# EasyEDA schematic SCH_Scope 1014D_2022-05-10.json

## Sheets
1 Scope_1014D_Processor: TITLE: Processor; REV: 1.0; Date: 2022-05-08; Sheet: 1/6
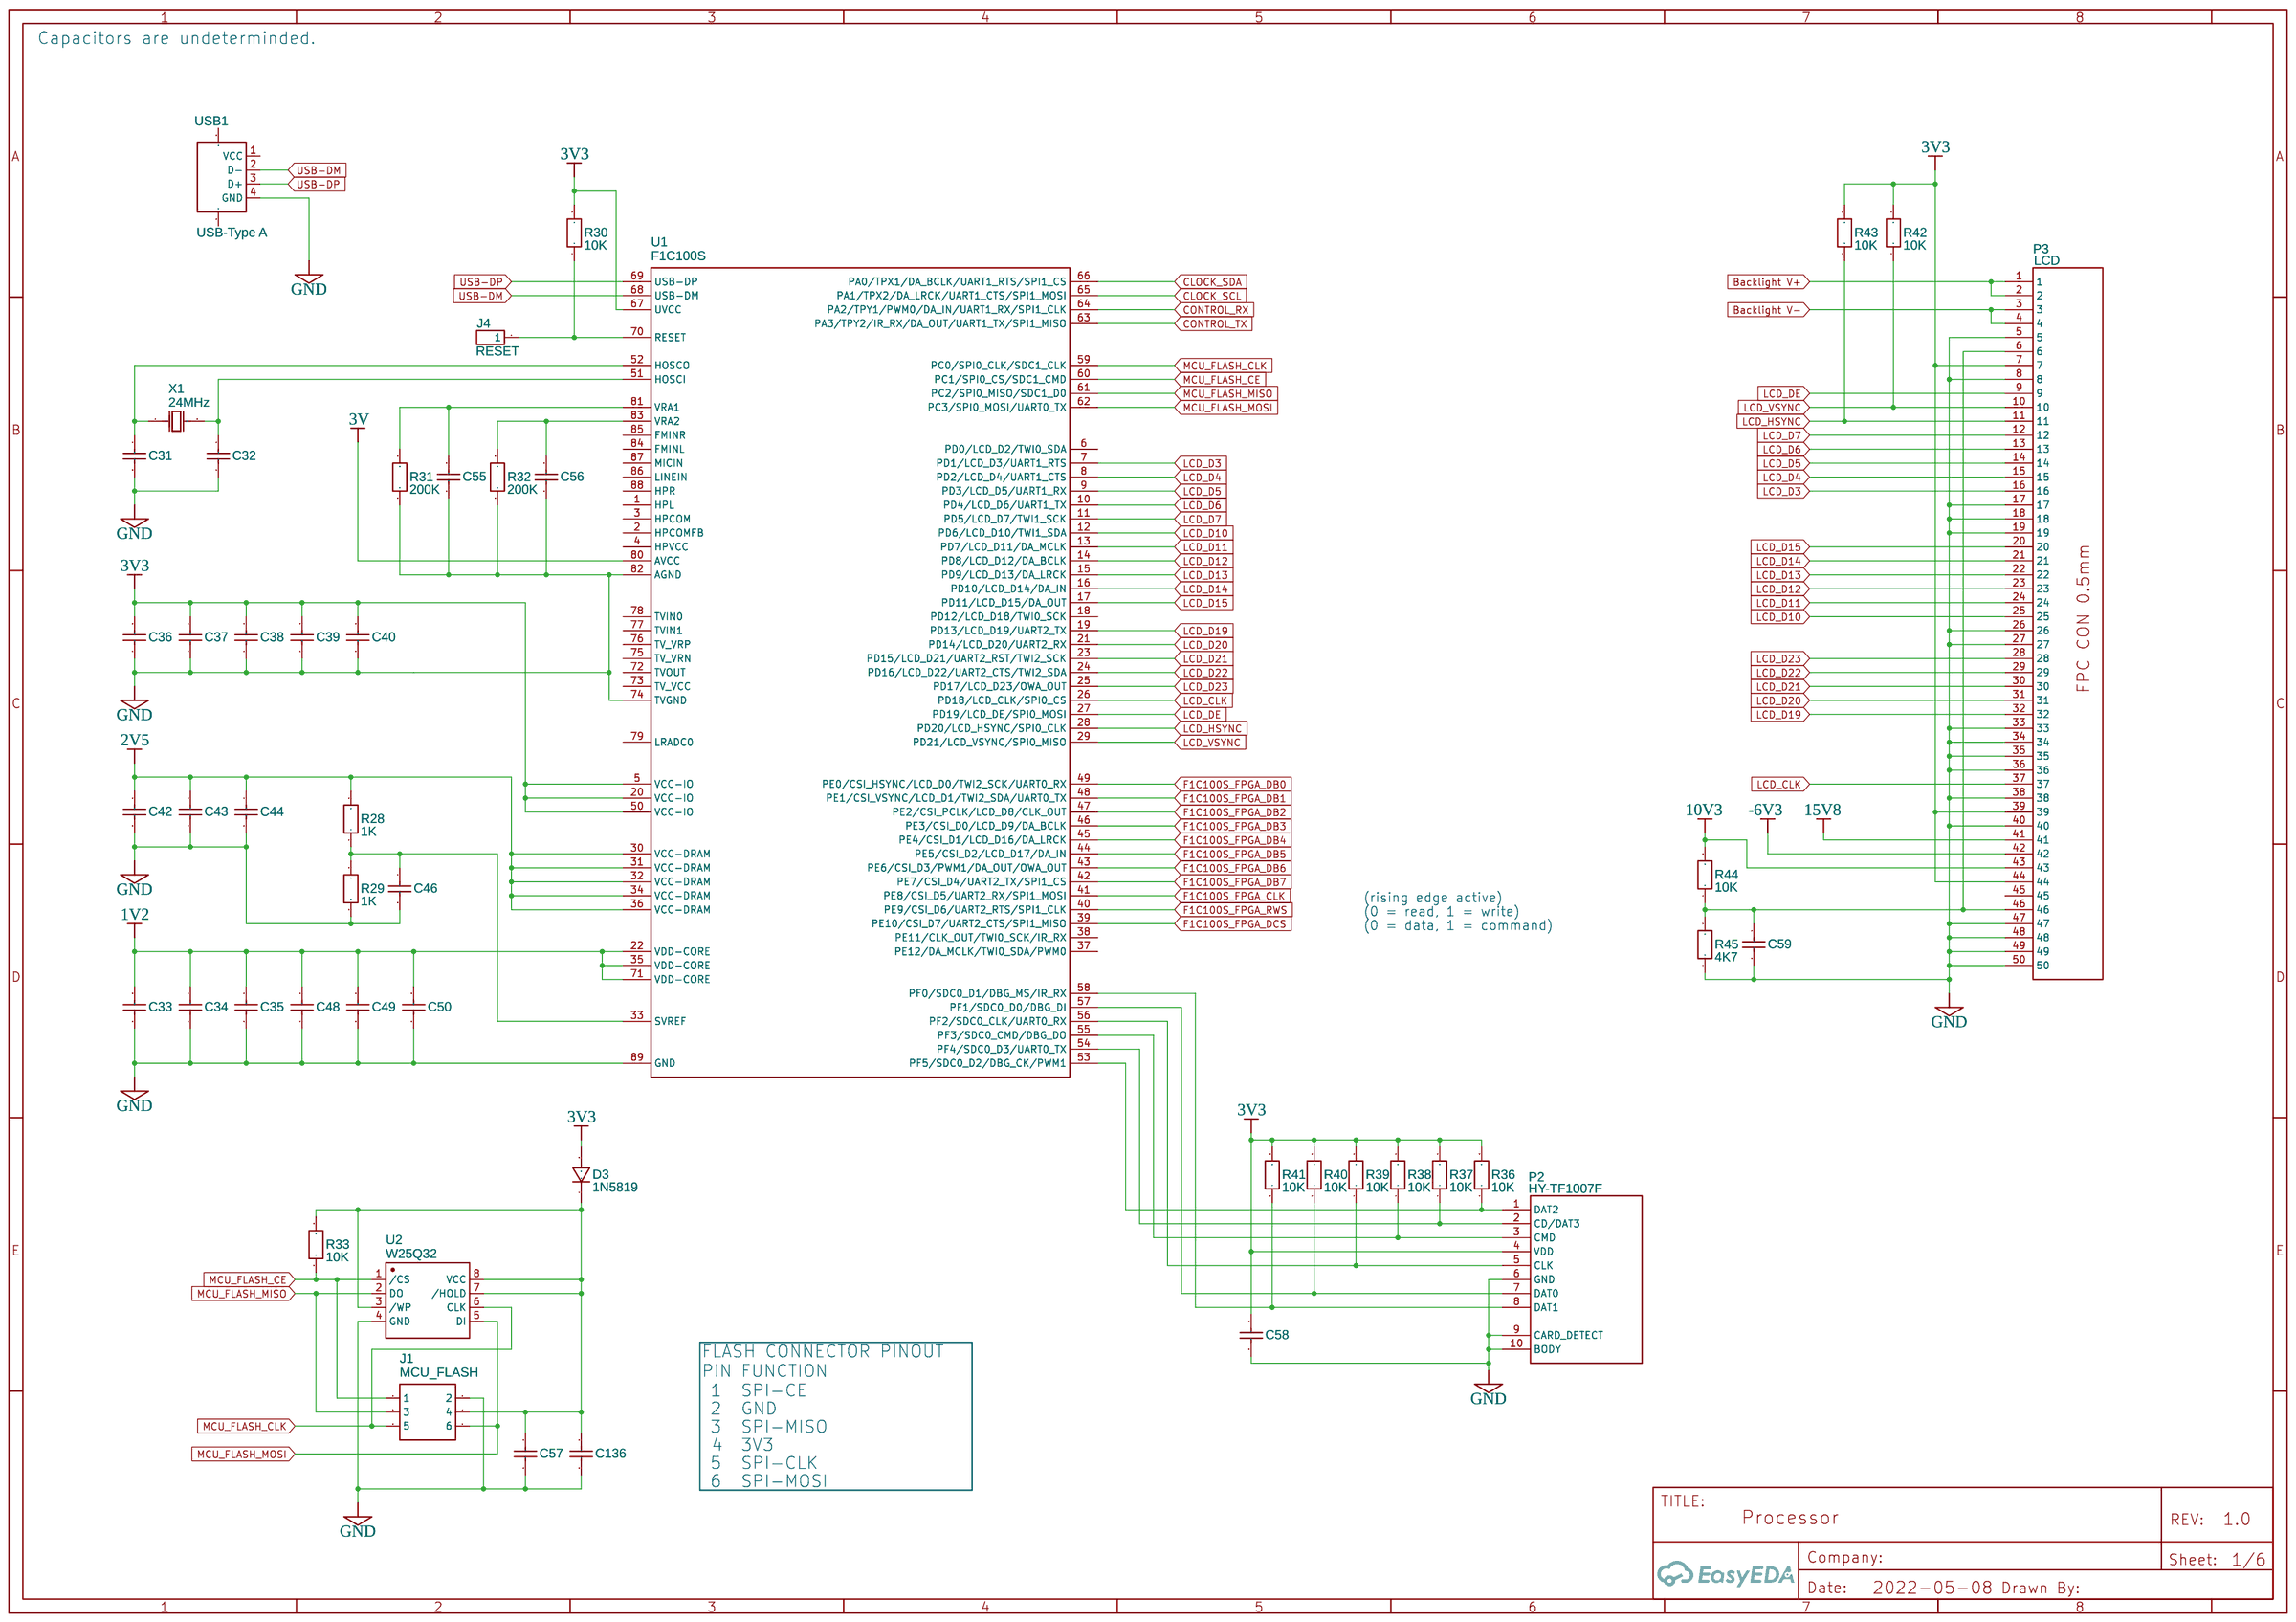
[diagram p0: Scope_1014D_Processor]
2 Scope_1014D_Data_Acquisition: TITLE: FPGA; Sheet: 2/6
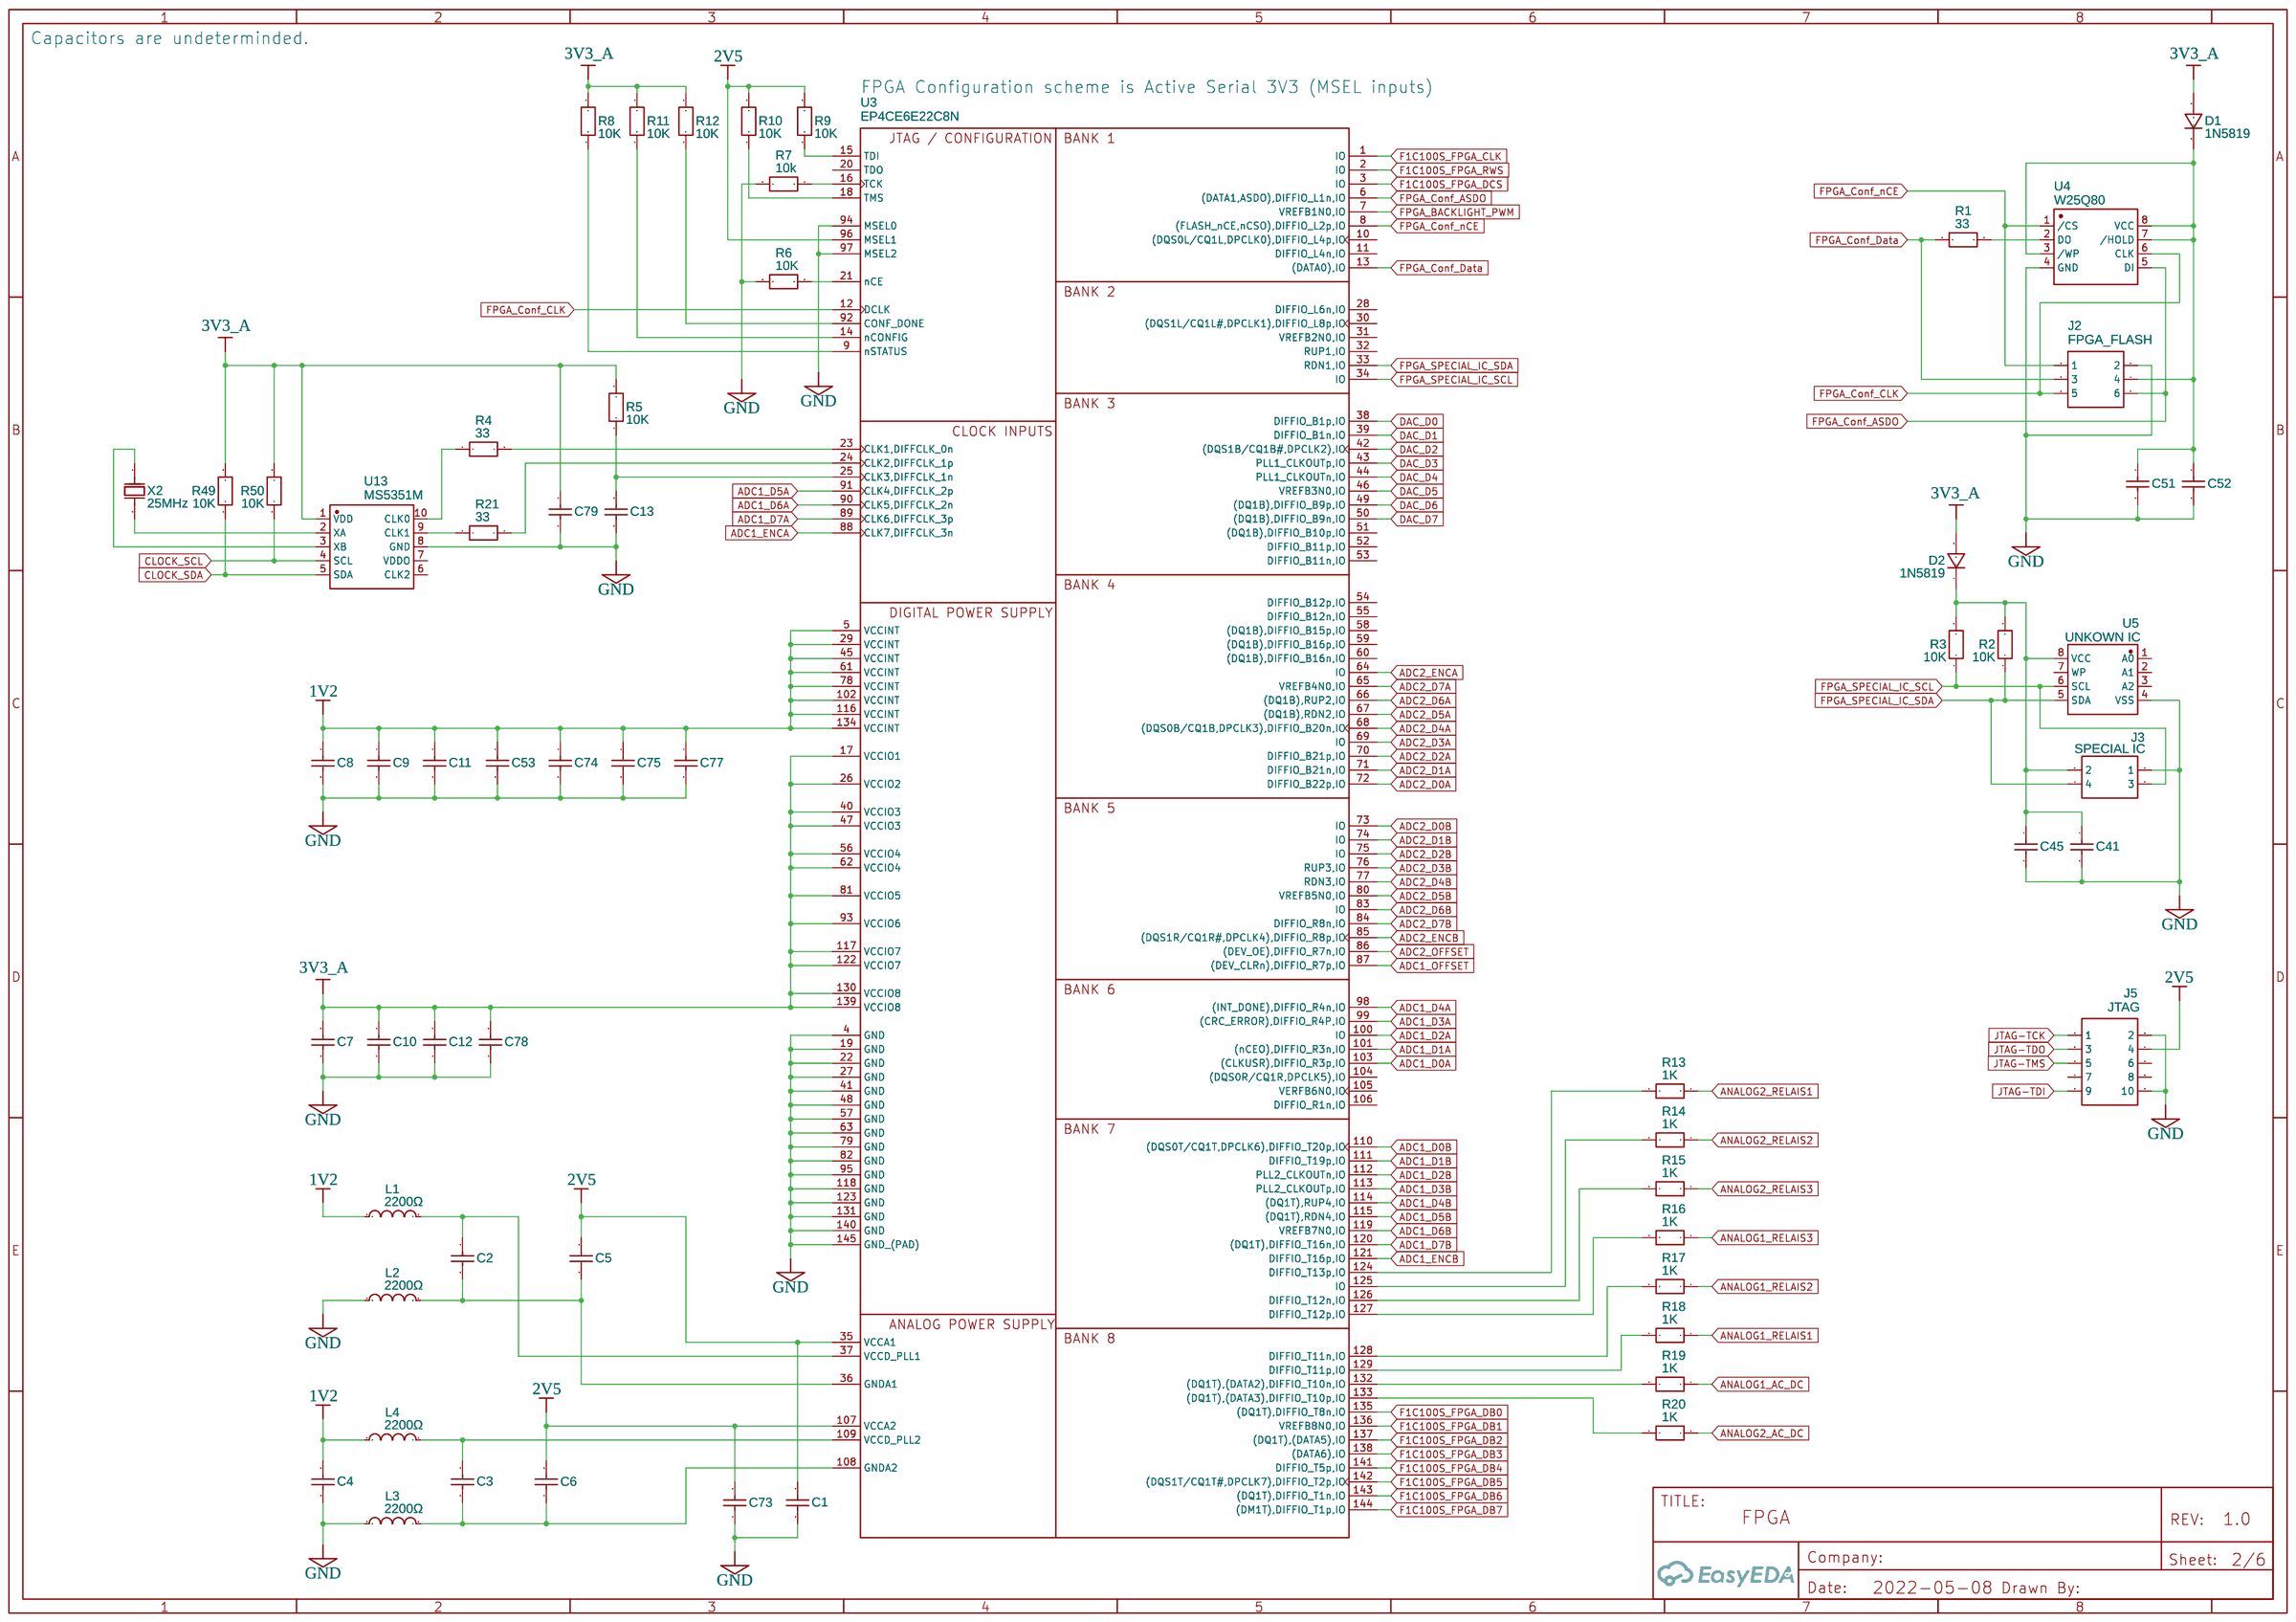
[diagram p1: Scope_1014D_Data_Acquisition]
3 Scope_1014D_Analog_Input: TITLE: Analog Input; Sheet: 4/6
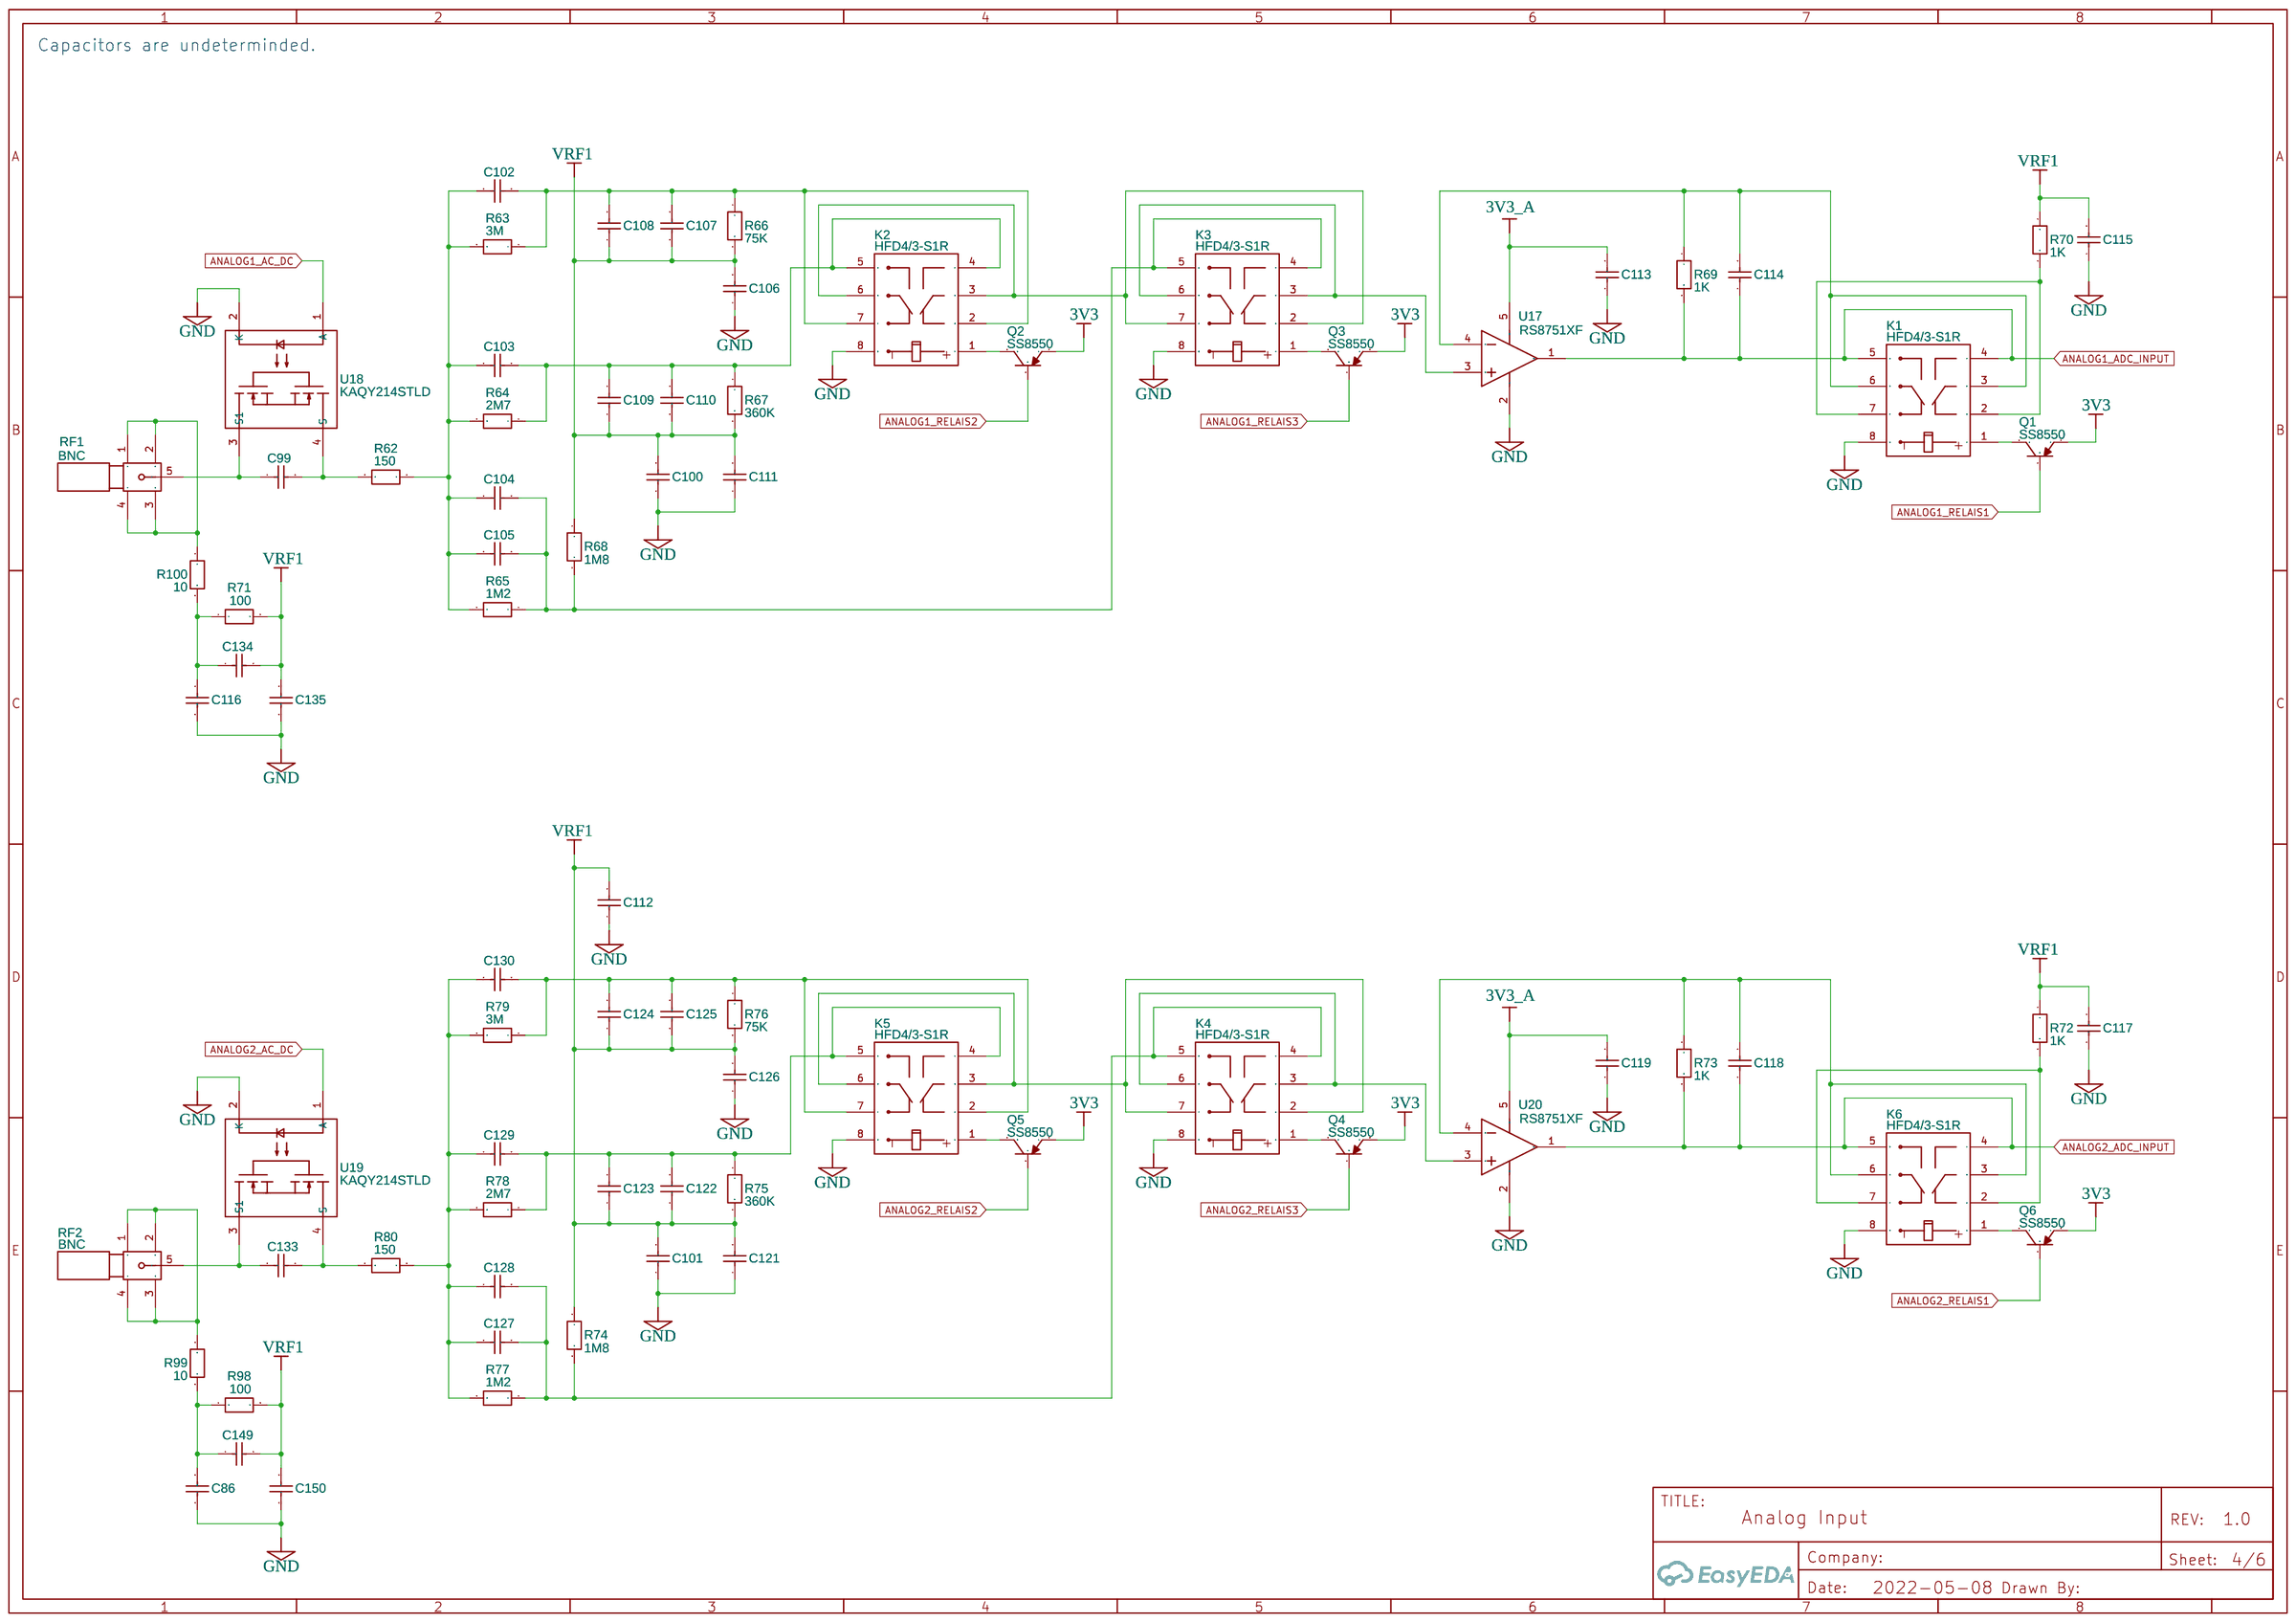
[diagram p2: Scope_1014D_Analog_Input]
4 Scope_1014D_Power_Supply: TITLE: Power Supply; Sheet: 6/6
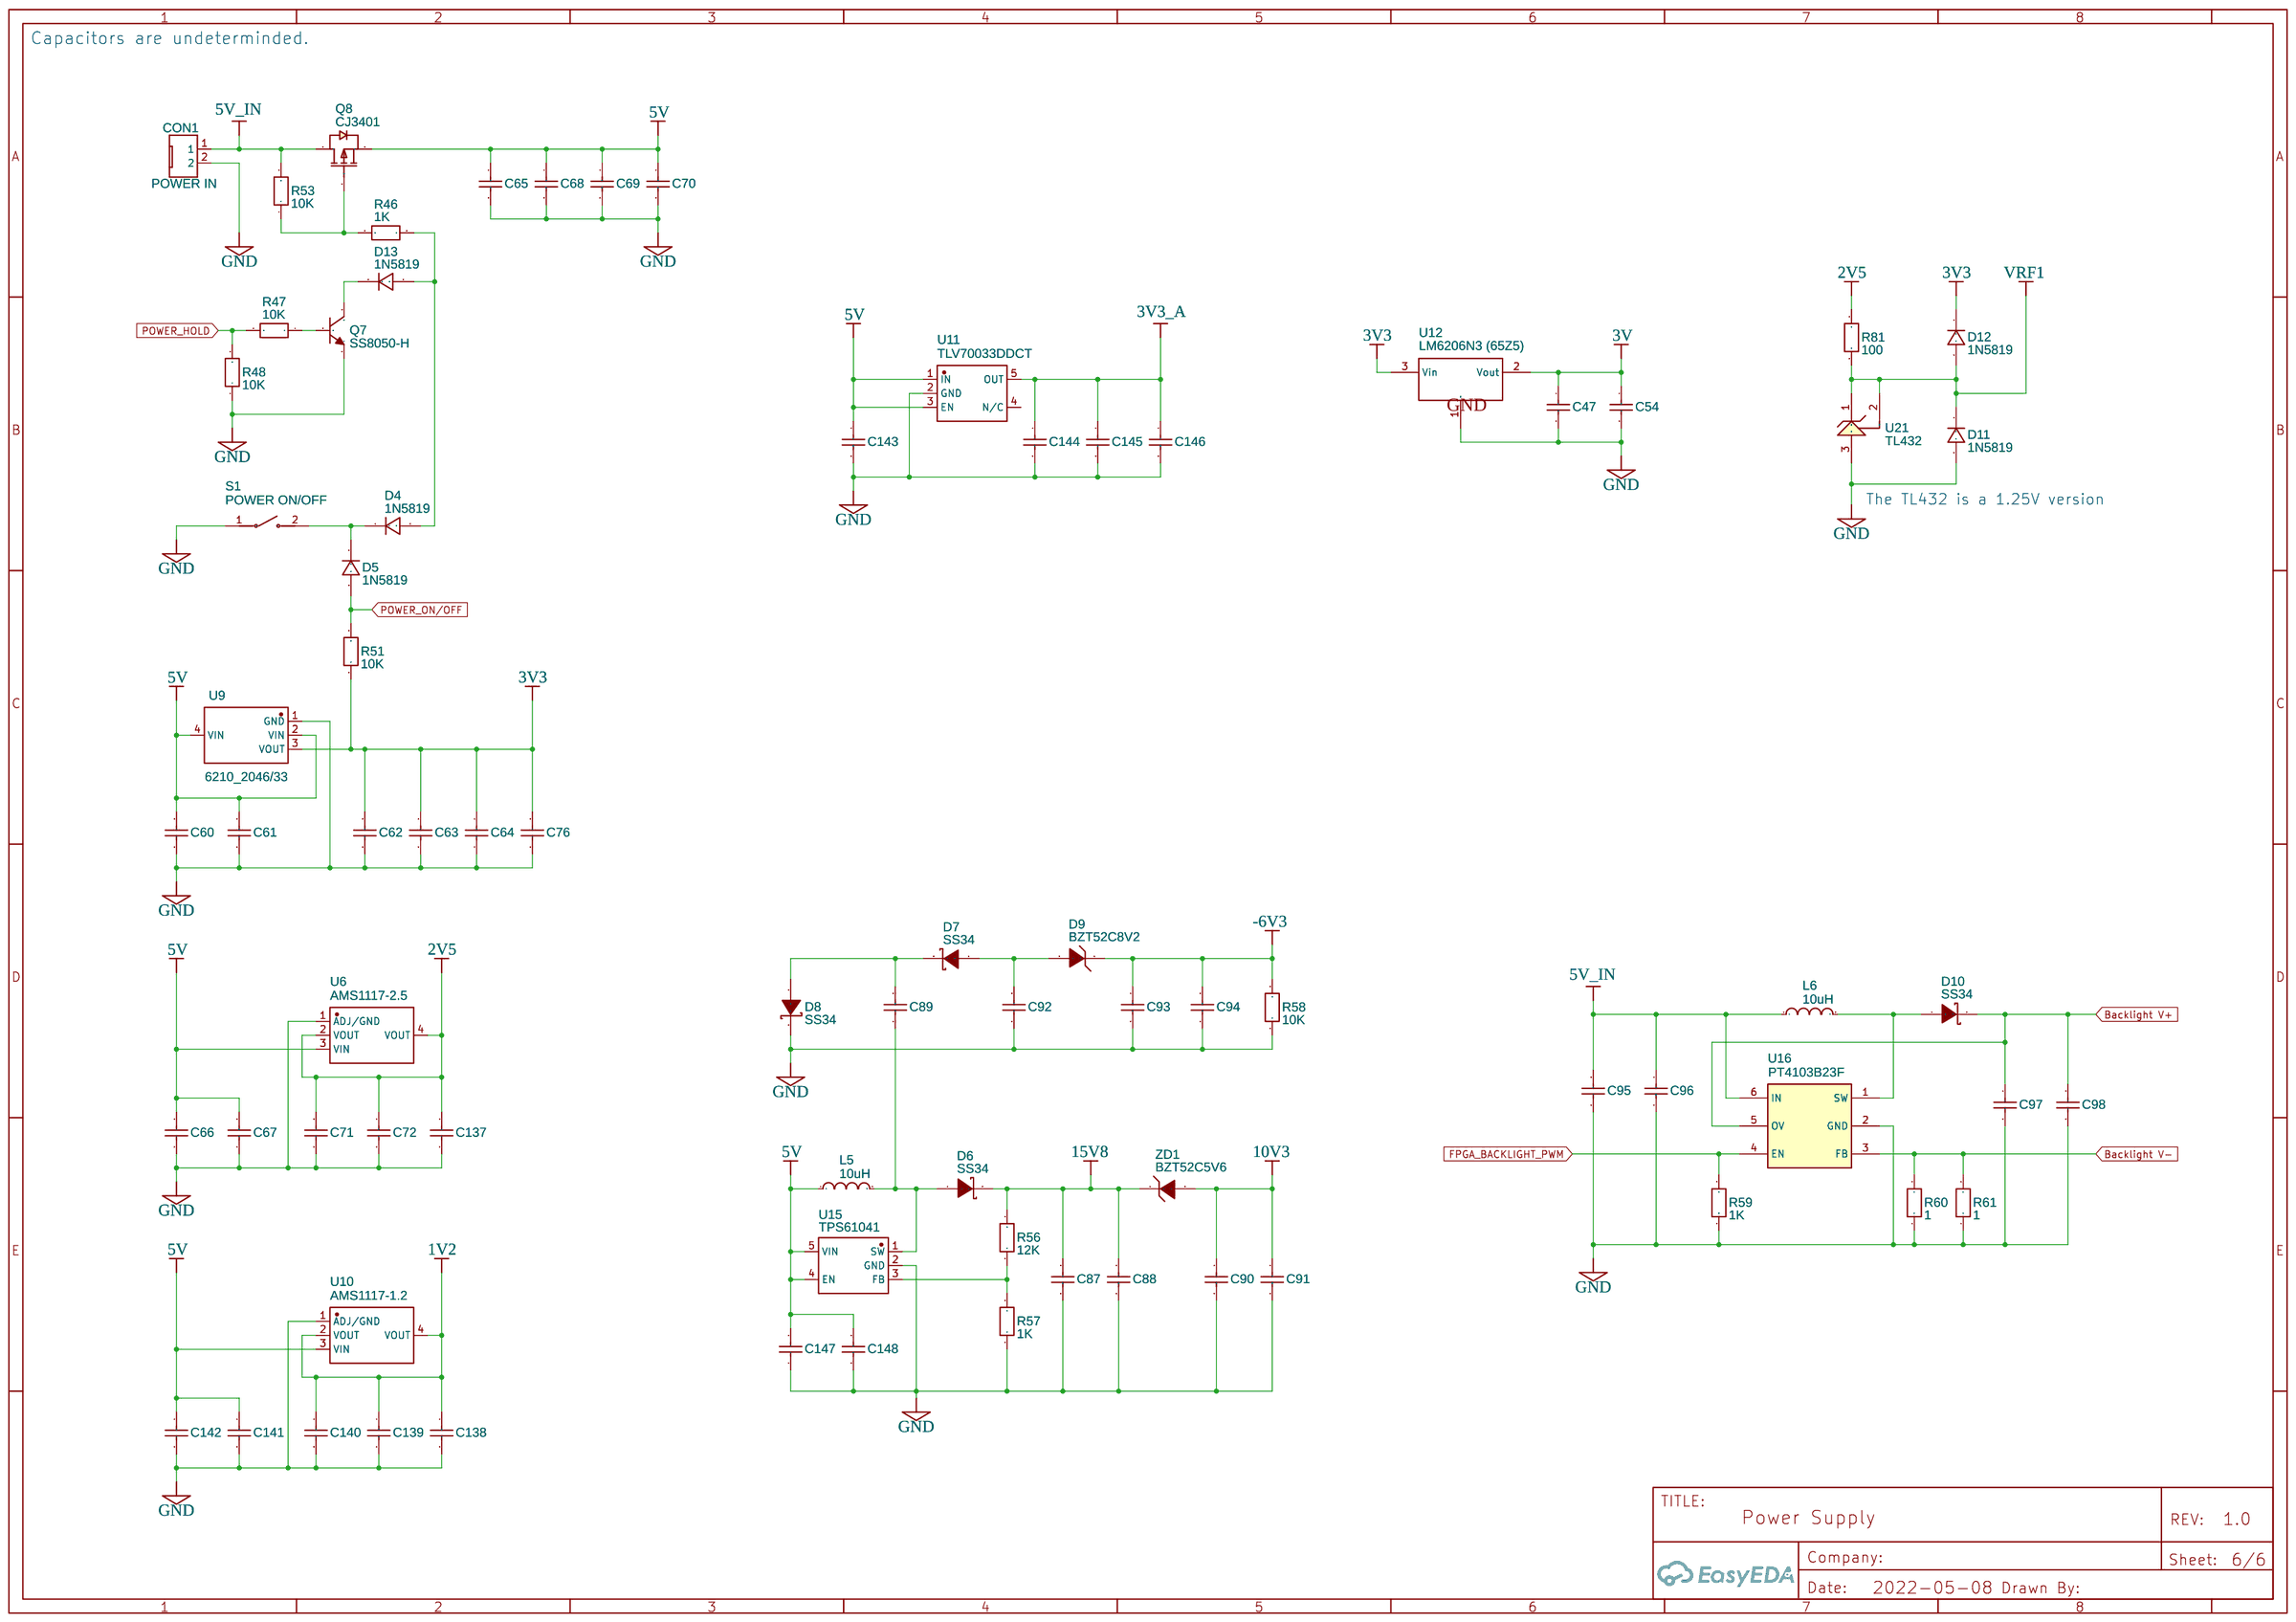
[diagram p3: Scope_1014D_Power_Supply]
5 Scope_1014D_ADC_DAC: TITLE: ADC's and DAC; Sheet: 3/6; Drawn By: petercost3
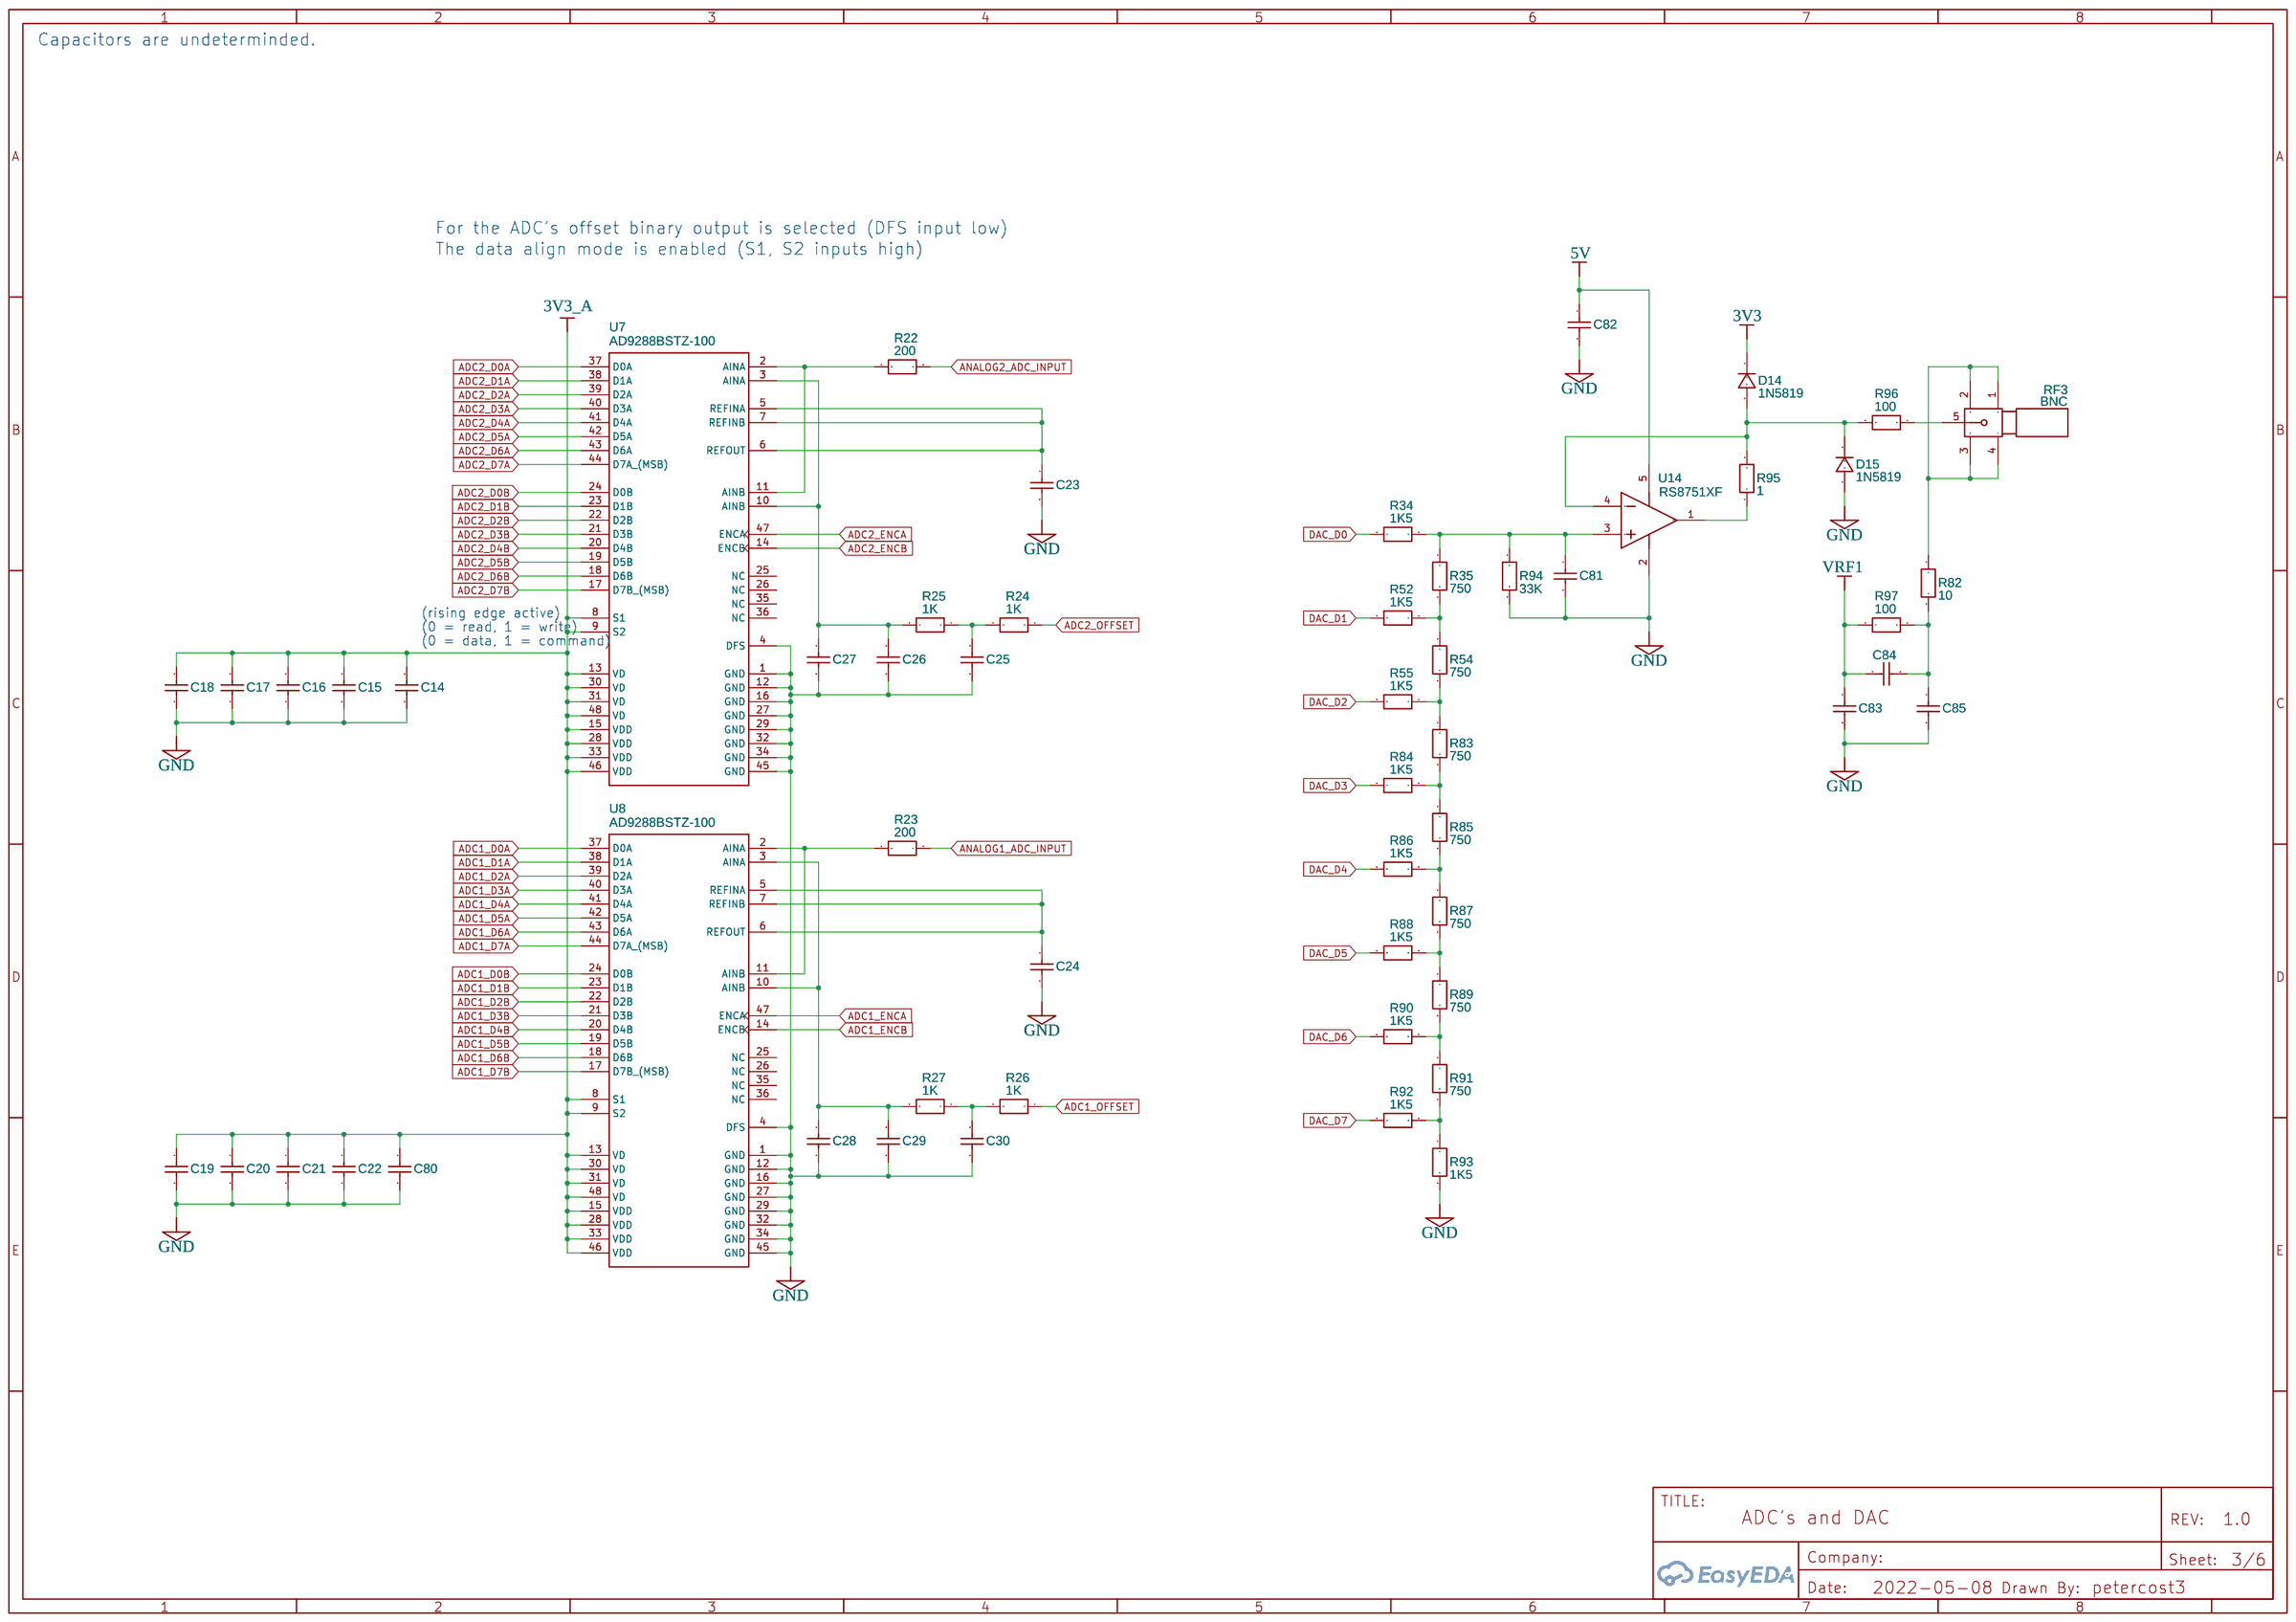
[diagram p4: Scope_1014D_ADC_DAC]
6 Scope_1014D_User_Interface: TITLE: User Interface; Date: 2022-05-09; Sheet: 5/6; Drawn By: petercost3
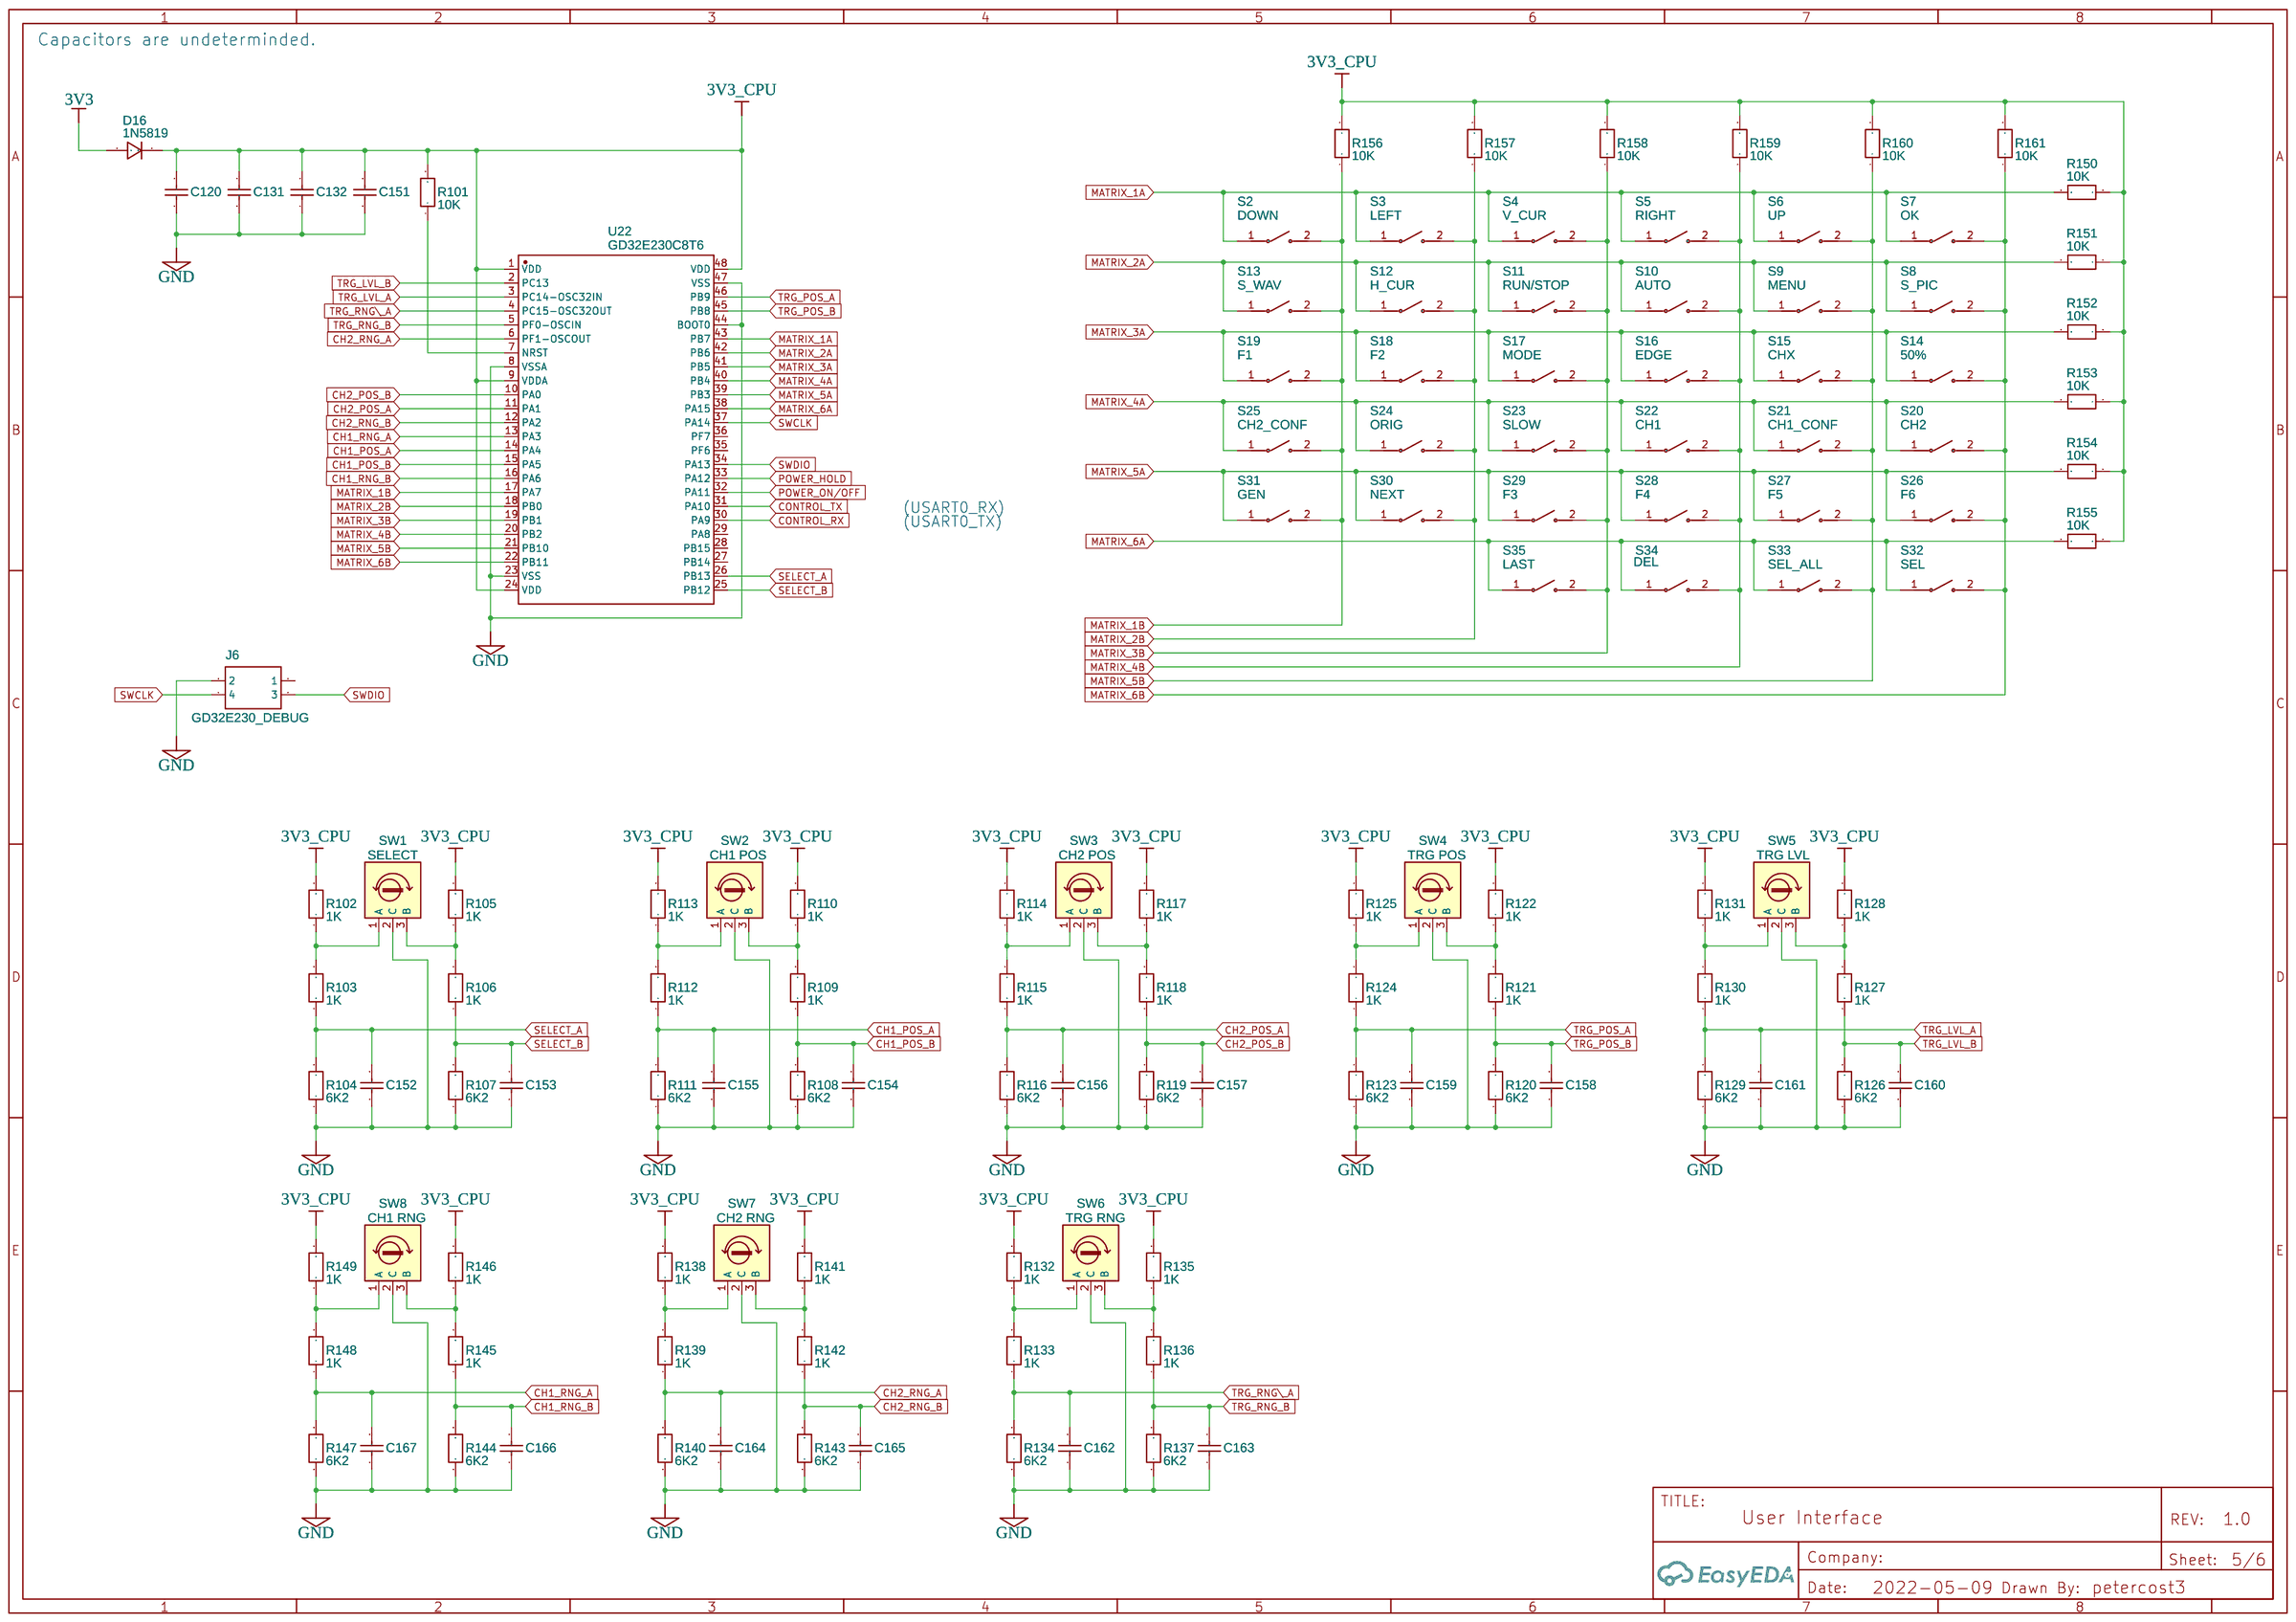
[diagram p5: Scope_1014D_User_Interface]

## Parts
sheet Scope_1014D_ADC_DAC
C14  1nF  [C_0805]
C15  1nF  [C_0805]
C16  1nF  [C_0805]
C17  1nF  [C_0805]
C18  1nF  [C_0805]
C19  1nF  [C_0805]
C20  1nF  [C_0805]
C21  1nF  [C_0805]
C22  1nF  [C_0805]
C23  1nF  [C_0805]
C24  1nF  [C_0805]
C25  1nF  [C_0805]
C26  1nF  [C_0805]
C27  1nF  [C_0805]
C28  1nF  [C_0805]
C29  1nF  [C_0805]
C30  1nF  [C_0805]
C80  1nF  [C_0805]
C81  1nF  [C_0805]
C82  1nF  [C_0805]
C83  1nF  [C_0805]
C84  1nF  [C_0805]
C85  1nF  [C_0805]
D14  1N5819  [LL34]
D15  1N5819  [LL34]
R22  200  [R0805]
R23  200  [R0805]
R24  1K  [R0805]
R25  1K  [R0805]
R26  1K  [R0805]
R27  1K  [R0805]
R34  1K5  [R0805]
R35  750  [R0805]
R52  1K5  [R0805]
R54  750  [R0805]
R55  1K5  [R0805]
R82  10  [R0805]
R83  750  [R0805]
R84  1K5  [R0805]
R85  750  [R0805]
R86  1K5  [R0805]
R87  750  [R0805]
R88  1K5  [R0805]
R89  750  [R0805]
R90  1K5  [R0805]
R91  750  [R0805]
R92  1K5  [R0805]
R93  1K5  [R0805]
R94  33K  [R0805]
R95  1  [R0805]
R96  100  [R0805]
R97  100  [R0805]
RF3  BNC  [BNC-TH_DOSIN-801-0080]
U7  AD9288BSTZ-100  [TQFP48]
U8  AD9288BSTZ-100  [TQFP48]
U14  RS8751XF  [SOT-23-5_L3.0-W1.7-P0.95-LS2.8-BL]
sheet Scope_1014D_Analog_Input
C86  1nF  [C_0805]
C99  1nF  [C_0805]
C100  1nF  [C_0805]
C101  1nF  [C_0805]
C102  1nF  [C_0805]
C103  1nF  [C_0805]
C104  1nF  [C_0805]
C105  1nF  [C_0805]
C106  1nF  [C_0805]
C107  1nF  [C_0805]
C108  1nF  [C_0805]
C109  1nF  [C_0805]
C110  1nF  [C_0805]
C111  1nF  [C_0805]
C112  1nF  [C_0805]
C113  1nF  [C_0805]
C114  1nF  [C_0805]
C115  1nF  [C_0805]
C116  1nF  [C_0805]
C117  1nF  [C_0805]
C118  1nF  [C_0805]
C119  1nF  [C_0805]
C121  1nF  [C_0805]
C122  1nF  [C_0805]
C123  1nF  [C_0805]
C124  1nF  [C_0805]
C125  1nF  [C_0805]
C126  1nF  [C_0805]
C127  1nF  [C_0805]
C128  1nF  [C_0805]
C129  1nF  [C_0805]
C130  1nF  [C_0805]
C133  1nF  [C_0805]
C134  1nF  [C_0805]
C135  1nF  [C_0805]
C149  1nF  [C_0805]
C150  1nF  [C_0805]
K1  HFD4/3-S1R  [RELAY-SMD_HFD4-3-S1R]
K2  HFD4/3-S1R  [RELAY-SMD_HFD4-3-S1R]
K3  HFD4/3-S1R  [RELAY-SMD_HFD4-3-S1R]
K4  HFD4/3-S1R  [RELAY-SMD_HFD4-3-S1R]
K5  HFD4/3-S1R  [RELAY-SMD_HFD4-3-S1R]
K6  HFD4/3-S1R  [RELAY-SMD_HFD4-3-S1R]
Q1  SS8550  [SOT-23-3_L2.9-W1.3-P1.90-LS2.4-BR]
Q2  SS8550  [SOT-23-3_L2.9-W1.3-P1.90-LS2.4-BR]
Q3  SS8550  [SOT-23-3_L2.9-W1.3-P1.90-LS2.4-BR]
Q4  SS8550  [SOT-23-3_L2.9-W1.3-P1.90-LS2.4-BR]
Q5  SS8550  [SOT-23-3_L2.9-W1.3-P1.90-LS2.4-BR]
Q6  SS8550  [SOT-23-3_L2.9-W1.3-P1.90-LS2.4-BR]
R62  150  [R0805]
R63  3M  [R0805]
R64  2M7  [R0805]
R65  1M2  [R0805]
R66  75K  [R0805]
R67  360K  [R0805]
R68  1M8  [R0805]
R69  1K  [R0805]
R70  1K  [R0805]
R71  100  [R0805]
R72  1K  [R0805]
R73  1K  [R0805]
R74  1M8  [R0805]
R75  360K  [R0805]
R76  75K  [R0805]
R77  1M2  [R0805]
R78  2M7  [R0805]
R79  3M  [R0805]
R80  150  [R0805]
R98  100  [R0805]
R99  10  [R0805]
R100  10  [R0805]
RF1  BNC  [BNC-TH_DOSIN-801-0080]
RF2  BNC  [BNC-TH_DOSIN-801-0080]
U17  RS8751XF  [SOT-23-5_L3.0-W1.7-P0.95-LS2.8-BL]
U18  KAQY214STLD  [SOP-4_L3.9-W4.4-P2.54-LS7.0-BR]
U19  KAQY214STLD  [SOP-4_L3.9-W4.4-P2.54-LS7.0-BR]
U20  RS8751XF  [SOT-23-5_L3.0-W1.7-P0.95-LS2.8-BL]
sheet Scope_1014D_Data_Acquisition
C1  1nF  [C_0805]
C2  1nF  [C_0805]
C3  1nF  [C_0805]
C4  1nF  [C_0805]
C5  1nF  [C_0805]
C6  1nF  [C_0805]
C7  1nF  [C_0805]
C8  1nF  [C_0805]
C9  1nF  [C_0805]
C10  1nF  [C_0805]
C11  1nF  [C_0805]
C12  1nF  [C_0805]
C13  1nF  [C_0805]
C41  1nF  [C_0805]
C45  1nF  [C_0805]
C51  1nF  [C_0805]
C52  1nF  [C_0805]
C53  1nF  [C_0805]
C73  1nF  [C_0805]
C74  1nF  [C_0805]
C75  1nF  [C_0805]
C77  1nF  [C_0805]
C78  1nF  [C_0805]
C79  1nF  [C_0805]
D1  1N5819  [LL34]
D2  1N5819  [LL34]
J2  FPGA_FLASH  [HDR-M-2.54_2X3]
J3  SPECIAL IC  [HDR-M-2.54_2X2]
J5  JTAG  [HDR-M-2.54_2X5]
L1  2200Ω  [0805]
L2  2200Ω  [0805]
L3  2200Ω  [0805]
L4  2200Ω  [0805]
R1  33  [R0805]
R2  10K  [R0805]
R3  10K  [R0805]
R4  33  [R0805]
R5  10K  [R0805]
R6  10K  [R0805]
R7  10k  [R0805]
R8  10K  [R0805]
R9  10K  [R0805]
R10  10K  [R0805]
R11  10K  [R0805]
R12  10K  [R0805]
R13  1K  [R0805]
R14  1K  [R0805]
R15  1K  [R0805]
R16  1K  [R0805]
R17  1K  [R0805]
R18  1K  [R0805]
R19  1K  [R0805]
R20  1K  [R0805]
R21  33  [R0805]
R49  10K  [R0805]
R50  10K  [R0805]
U3  EP4CE6E22C8N  [PQFP-144_L20.0-W20.0-P0.50-LS22.0-BL-EP]
U4  W25Q80  [SOIC-8_L5.3-W5.3-P1.27-LS8.0-BL]
U5  UNKOWN IC  [SOIC-8_L4.9-W3.9-P1.27-LS6.0-BL]
U13  MS5351M  [MSOP-10_L3.0-W3.0-P0.50-LS5.0-BL]
X2  25MHz  [OSC-SMD_L5.0-W3.2]
sheet Scope_1014D_Power_Supply
C47  1nF  [C_0805]
C54  1nF  [C_0805]
C60  1nF  [C_0805]
C61  1nF  [C_0805]
C62  1nF  [C_0805]
C63  1nF  [C_0805]
C64  1nF  [C_0805]
C65  1nF  [C_0805]
C66  1nF  [C_0805]
C67  1nF  [C_0805]
C68  1nF  [C_0805]
C69  1nF  [C_0805]
C70  1nF  [C_0805]
C71  1nF  [C_0805]
C72  1nF  [C_0805]
C76  1nF  [C_0805]
C87  1nF  [C_0805]
C88  1nF  [C_0805]
C89  1nF  [C_0805]
C90  1nF  [C_0805]
C91  1nF  [C_0805]
C92  1nF  [C_0805]
C93  1nF  [C_0805]
C94  1nF  [C_0805]
C95  1nF  [C_0805]
C96  1nF  [C_0805]
C97  1nF  [C_0805]
C98  1nF  [C_0805]
C137  1nF  [C_0805]
C138  1nF  [C_0805]
C139  1nF  [C_0805]
C140  1nF  [C_0805]
C141  1nF  [C_0805]
C142  1nF  [C_0805]
C143  1nF  [C_0805]
C144  1nF  [C_0805]
C145  1nF  [C_0805]
C146  1nF  [C_0805]
C147  1nF  [C_0805]
C148  1nF  [C_0805]
CON1  POWER IN  [XH2.54-2P-V]
D4  1N5819  [LL34]
D5  1N5819  [LL34]
D6  SS34  [SMC_L7.1-W6.2-LS8.1-RD]
D7  SS34  [SMC_L7.1-W6.2-LS8.1-RD]
D8  SS34  [SMC_L7.1-W6.2-LS8.1-RD]
D9  BZT52C8V2  [SOD-123_L2.8-W1.8-LS3.7-RD]
D10  SS34  [SMC_L7.1-W6.2-LS8.1-RD]
D11  1N5819  [LL34]
D12  1N5819  [LL34]
D13  1N5819  [LL34]
L5  10uH  [IND-SMD_L7.0-W7.0_SLF7055T]
L6  10uH  [IND-SMD_L7.0-W7.0_SLF7055T]
Q7  SS8050-H  [SOT-23-3_L2.9-W1.3-P1.90-LS2.4-BR]
Q8  CJ3401  [SOT-23-3_L2.9-W1.6-P1.90-LS2.8-BR]
R46  1K  [R0805]
R47  10K  [R0805]
R48  10K  [R0805]
R51  10K  [R0805]
R53  10K  [R0805]
R56  12K  [R0805]
R57  1K  [R0805]
R58  10K  [R0805]
R59  1K  [R0805]
R60  1  [R0805]
R61  1  [R0805]
R81  100  [R0805]
S1  POWER ON/OFF  [SW-SMD_L3.9-W2.9-LS4.9-L]
U6  AMS1117-2.5  [SOT-223_L6.3-W3.5-P2.30-LS7.0-BR]
U9  6210_2046/33  [SOT-223-3_L6.5-W3.4-P2.30-LS7.0-BR]
U10  AMS1117-1.2  [SOT-223_L6.3-W3.5-P2.30-LS7.0-BR]
U11  TLV70033DDCT  [SOT-23-5_L2.9-W1.6-P0.95-LS2.8-BR]
U12  LM6206N3 (65Z5)  [SOT-23(SOT-23-3)]
U15  TPS61041  [SOT-23-5_L3.0-W1.7-P0.95-LS2.8-BR]
U16  PT4103B23F  [SOT-23-6_L2.9-W1.6-P0.95-LS2.8-BR]
U21  TL432  [SOT23-3]
ZD1  BZT52C5V6  [SOD-123_L2.8-W1.8-LS3.7-RD]
sheet Scope_1014D_Processor
C31  1nF  [C_0805]
C32  1nF  [C_0805]
C33  1nF  [C_0805]
C34  1nF  [C_0805]
C35  1nF  [C_0805]
C36  1nF  [C_0805]
C37  1nF  [C_0805]
C38  1nF  [C_0805]
C39  1nF  [C_0805]
C40  1nF  [C_0805]
C42  1nF  [C_0805]
C43  1nF  [C_0805]
C44  1nF  [C_0805]
C46  1nF  [C_0805]
C48  1nF  [C_0805]
C49  1nF  [C_0805]
C50  1nF  [C_0805]
C55  1nF  [C_0805]
C56  1nF  [C_0805]
C57  1nF  [C_0805]
C58  1nF  [C_0805]
C59  1nF  [C_0805]
C136  1nF  [C_0805]
D3  1N5819  [LL34]
J1  MCU_FLASH  [HDR-M-2.54_2X3]
J4  RESET  [HDR-M-2.54_1X1]
P2  HY-TF1007F  [HY-TF1007F]
P3  LCD  [FPC 0.5 50 CON]
R28  1K  [R0805]
R29  1K  [R0805]
R30  10K  [R0805]
R31  200K  [R0805]
R32  200K  [R0805]
R33  10K  [R0805]
R36  10K  [R0805]
R37  10K  [R0805]
R38  10K  [R0805]
R39  10K  [R0805]
R40  10K  [R0805]
R41  10K  [R0805]
R42  10K  [R0805]
R43  10K  [R0805]
R44  10K  [R0805]
R45  4K7  [R0805]
U1  F1C100S  [QFN-88_10.0X10.0XP04MM]
U2  W25Q32  [SOIC-8_L5.3-W5.3-P1.27-LS8.0-BL]
USB1  USB-Type A  [USB-A-TH_48037-0001]
X1  24MHz  [OSC-SMD_L5.0-W3.2]
sheet Scope_1014D_User_Interface
C120  1nF  [C_0805]
C131  1nF  [C_0805]
C132  1nF  [C_0805]
C151  1nF  [C_0805]
C152  1nF  [C_0805]
C153  1nF  [C_0805]
C154  1nF  [C_0805]
C155  1nF  [C_0805]
C156  1nF  [C_0805]
C157  1nF  [C_0805]
C158  1nF  [C_0805]
C159  1nF  [C_0805]
C160  1nF  [C_0805]
C161  1nF  [C_0805]
C162  1nF  [C_0805]
C163  1nF  [C_0805]
C164  1nF  [C_0805]
C165  1nF  [C_0805]
C166  1nF  [C_0805]
C167  1nF  [C_0805]
D16  1N5819  [LL34]
J6  GD32E230_DEBUG  [HDR-M-2.54_2X2]
R101  10K  [R0805]
R102  1K  [R0805]
R103  1K  [R0805]
R104  6K2  [R0805]
R105  1K  [R0805]
R106  1K  [R0805]
R107  6K2  [R0805]
R108  6K2  [R0805]
R109  1K  [R0805]
R110  1K  [R0805]
R111  6K2  [R0805]
R112  1K  [R0805]
R113  1K  [R0805]
R114  1K  [R0805]
R115  1K  [R0805]
R116  6K2  [R0805]
R117  1K  [R0805]
R118  1K  [R0805]
R119  6K2  [R0805]
R120  6K2  [R0805]
R121  1K  [R0805]
R122  1K  [R0805]
R123  6K2  [R0805]
R124  1K  [R0805]
R125  1K  [R0805]
R126  6K2  [R0805]
R127  1K  [R0805]
R128  1K  [R0805]
R129  6K2  [R0805]
R130  1K  [R0805]
R131  1K  [R0805]
R132  1K  [R0805]
R133  1K  [R0805]
R134  6K2  [R0805]
R135  1K  [R0805]
R136  1K  [R0805]
R137  6K2  [R0805]
R138  1K  [R0805]
R139  1K  [R0805]
R140  6K2  [R0805]
R141  1K  [R0805]
R142  1K  [R0805]
R143  6K2  [R0805]
R144  6K2  [R0805]
R145  1K  [R0805]
R146  1K  [R0805]
R147  6K2  [R0805]
R148  1K  [R0805]
R149  1K  [R0805]
R150  10K  [R0805]
R151  10K  [R0805]
R152  10K  [R0805]
R153  10K  [R0805]
R154  10K  [R0805]
R155  10K  [R0805]
R156  10K  [R0805]
R157  10K  [R0805]
R158  10K  [R0805]
R159  10K  [R0805]
R160  10K  [R0805]
R161  10K  [R0805]
S2  DOWN  [SW-SMD_L3.9-W2.9-LS4.9-L]
S3  LEFT  [SW-SMD_L3.9-W2.9-LS4.9-L]
S4  V_CUR  [SW-SMD_L3.9-W2.9-LS4.9-L]
S5  RIGHT  [SW-SMD_L3.9-W2.9-LS4.9-L]
S6  UP  [SW-SMD_L3.9-W2.9-LS4.9-L]
S7  OK  [SW-SMD_L3.9-W2.9-LS4.9-L]
S8  S_PIC  [SW-SMD_L3.9-W2.9-LS4.9-L]
S9  MENU  [SW-SMD_L3.9-W2.9-LS4.9-L]
S10  AUTO  [SW-SMD_L3.9-W2.9-LS4.9-L]
S11  RUN/STOP  [SW-SMD_L3.9-W2.9-LS4.9-L]
S12  H_CUR  [SW-SMD_L3.9-W2.9-LS4.9-L]
S13  S_WAV  [SW-SMD_L3.9-W2.9-LS4.9-L]
S14  50%  [SW-SMD_L3.9-W2.9-LS4.9-L]
S15  CHX  [SW-SMD_L3.9-W2.9-LS4.9-L]
S16  EDGE  [SW-SMD_L3.9-W2.9-LS4.9-L]
S17  MODE  [SW-SMD_L3.9-W2.9-LS4.9-L]
S18  F2  [SW-SMD_L3.9-W2.9-LS4.9-L]
S19  F1  [SW-SMD_L3.9-W2.9-LS4.9-L]
S20  CH2  [SW-SMD_L3.9-W2.9-LS4.9-L]
S21  CH1_CONF  [SW-SMD_L3.9-W2.9-LS4.9-L]
S22  CH1  [SW-SMD_L3.9-W2.9-LS4.9-L]
S23  SLOW  [SW-SMD_L3.9-W2.9-LS4.9-L]
S24  ORIG  [SW-SMD_L3.9-W2.9-LS4.9-L]
S25  CH2_CONF  [SW-SMD_L3.9-W2.9-LS4.9-L]
S26  F6  [SW-SMD_L3.9-W2.9-LS4.9-L]
S27  F5  [SW-SMD_L3.9-W2.9-LS4.9-L]
S28  F4  [SW-SMD_L3.9-W2.9-LS4.9-L]
S29  F3  [SW-SMD_L3.9-W2.9-LS4.9-L]
S30  NEXT  [SW-SMD_L3.9-W2.9-LS4.9-L]
S31  GEN  [SW-SMD_L3.9-W2.9-LS4.9-L]
S32  SEL  [SW-SMD_L3.9-W2.9-LS4.9-L]
S33  SEL_ALL  [SW-SMD_L3.9-W2.9-LS4.9-L]
S34  DEL  [SW-SMD_L3.9-W2.9-LS4.9-L]
S35  LAST  [SW-SMD_L3.9-W2.9-LS4.9-L]
SW1  SELECT
SW2  CH1 POS
SW3  CH2 POS
SW4  TRG POS
SW5  TRG LVL
SW6  TRG RNG
SW7  CH2 RNG
SW8  CH1 RNG
U22  GD32E230C8T6  [LQFP-48_L7.0-W7.0-P0.50-LS9.0-BL]

## Library data of the parts
C1-C167 = GRM31B7U3A471JW31L: Supplier: LCSC; Manufacturer: MuRata; Supplier Part: C97936
D1-D5 D11-D16 = 1N4007: Supplier: LCSC; Manufacturer: SEMTECH; Supplier Part: C106903; Contributor: LCEDA_Lib
R1-R161 = R_0805_EU: Contributor: LCEDA_Lib
RF1-RF3 = DOSIN-801-0080: Supplier: LCSC; Supplier Part: C521219; Manufacturer: dosinconn; Contributor: LCSC
U7 U8 = AD9288BSTZ-100: Dual 8-Bit Analog-to-Digital Converter with Parallel Interface, 100MSPS, -40 to +85 degC, ST-48, Pb-Free, Tray
U14 U17 U20 = RS8751XF: Supplier: LCSC; Supplier Part: C236995; Manufacturer: RUNIC(  ); Contributor: LCSC
K1-K6 = HFD4/3-S1R: Supplier: LCSC; Manufacturer: HF; Contributor: LCSC; Supplier Part: C143232
Q1-Q6 = SS8550: Supplier: LCSC; Supplier Part: C909745; Manufacturer: GOODWORK(固得沃克); Contributor: LCSC
U18 U19 = KAQY214STLD: Supplier: LCSC; Manufacturer: COSMO; Contributor: LCSC; Supplier Part: C113331; SMT Type: Extend; JLCPCB SMD: Yes; Paste Type: recommend
J1 J2 = HDR-M-2.54_2x3: Supplier Part: C65114; Supplier: LCSC; Contributor: LCEDA_Lib
J3 J6 = HDR-M-2.54_2x2: Supplier Part: C66690; Supplier: LCSC; Contributor: LCEDA_Lib
J5 = HDR-M-2.54_2x5: Supplier Part: C178292; Supplier: LCSC; Contributor: LCEDA_Lib
L1-L4 = BLM21PG221SN1D: Supplier: LCSC; Manufacturer: MuRata; Supplier Part: C85840
U3 = EP4CE6E22C8N: Contributor: petercost3
U2 U4 = W25Q32FVSSIGTR: Supplier: LCSC; Manufacturer: WINBOND; Supplier Part: C108057
U5 = 24LC04BT-I/SN: Supplier: LCSC; Supplier Part: C511263; Manufacturer: Microchip Tech; Contributor: LCSC; SMT Type: Extend; JLCPCB SMD: Yes; LCSC Assembly: Yes; Paste Type: expand
U13 = MS5351M: Supplier: LCSC; Supplier Part: C1509083; Manufacturer: 杭州瑞盟; Contributor: LCSC; JLCPCB Part Class: Extended Part
X1 X2 = X503224MSD2GC: Supplier Part: C48304; Supplier: LCSC; Manufacturer: YXC; image: http://image.lceda.cn/szlcsc/C48304.jpg; SMT Type: Extend; JLCPCB SMD: Yes; LCSC Assembly: Yes; Paste Type: expand
CON1 = XH2.54-2P: Contributor: vndtiger
D6-D8 D10 = SS34: Supplier: LCSC; Manufacturer: MDD; image: //image.lceda.cn/szlcsc/C13763.jpg; Supplier Part: C13763; SMT Type: Extend; JLCPCB SMD: Yes; LCSC Assembly: Yes; Paste Type: expand
D9 = BZT52C8V2: Supplier: LCSC; Manufacturer: CJ; Supplier Part: C2122; SMT Type: Extend; JLCPCB SMD: Yes; LCSC Assembly: Yes; Paste Type: expand
L5 L6 = SMDRI74-101MT: Supplier: LCSC; Manufacturer: SXN; Supplier Part: C36970
Q7 = SS8050-H: Supplier: LCSC; Supplier Part: C699255; Manufacturer: Yangzhou Yangjie Elec Tech; Contributor: LCSC; JLCPCB Part Class: Extended Part
Q8 = CJ3401: Supplier: LCSC; Manufacturer: CJ; Supplier Part: C13799; JLCPCB Part Class: Extended Part
S1-S35 = BUTTON: Supplier: LCSC; Supplier Part: C9900015607; Manufacturer: null; JLCPCB Part Class: Extended Part; Contributor: lcsc
U6 = AMS1117-2.5_C963405: Supplier: LCSC; Supplier Part: C963405; Manufacturer: JSMSEMI(杰盛微); Contributor: LCSC; JLCPCB Part Class: Extended Part
U9 = 6210_2046/33: Supplier Part: C622711; Manufacturer: MICROCHIP(美国微芯); Manufacturer Part: TC1108-3.3VDBTR; link: https://atta.szlcsc.com/upload/public/pdf/source/20220322/078720A688B2C6011AEB04FDCDCFFAC0.pdf; Contributor: petercost3
U10 = AMS1117-2.5_C963405: Supplier: LCSC; Supplier Part: C963405; Manufacturer: JSMSEMI(杰盛微); Manufacturer Part: AMS1117-2.5; Contributor: LCSC; JLCPCB Part Class: Extended Part
U11 = TLV70033DDCT: Supplier: LCSC; Supplier Part: C2877582; Manufacturer: TI(德州仪器); link: https://atta.szlcsc.comnull; Contributor: lcsc
U12 = LM6206N3: Supplier: LCSC; Supplier Part: LM6206N3 (662K); Manufacturer: https://www.mikrocontroller.net/attachment/193855/LM6206N3.pdf; Contributor: Christian Mehrhoff; link: https://www.mikrocontroller.net/attachment/193855/LM6206N3.pdf
U15 = TPS61040DBVR: Supplier: LCSC; Manufacturer: TI; image: //image.lceda.cn/szlcsc/C7722.jpg; Supplier Part: C7722; SMT Type: Basic; JLCPCB SMD: Yes; LCSC Assembly: Yes; Paste Type: base
U16 = PT4103B23F: Supplier: LCSC; Manufacturer: PowTech; image: //image.lceda.cn/szlcsc/C19861.jpg; Supplier Part: C19861; SMT Type: Extend; JLCPCB SMD: Yes; LCSC Assembly: Yes; Paste Type: expand
U21 = TL431AIDBZTG4: Adjustable Precision Shunt Regulator, 34 ppm  degC, 100 mA, -40 to 85 degC, 3-pin SOT-23 (DBZ), Green (RoHS  no SbBr)
ZD1 = BZT52C5V6: Supplier: LCSC; Manufacturer: CJ; image: //image.lceda.cn/szlcsc/C2119.jpg; Supplier Part: C2119; SMT Type: Extend; JLCPCB SMD: Yes; LCSC Assembly: Yes; Paste Type: expand
J4 = HDR-M-2.54_1x1: Supplier Part: C81276; Supplier: LCSC; Contributor: LCEDA_Lib
P2 = HY-TF1007F: Contributor: udi.builder; Supplier Part: undefined; Supplier: LCSC
P3 = FPC CONNECTOR 50P 0.5mm: Contributor: Lucoa_Quetz
U1 = F1C100S: Contributor: petercost3
USB1 = USB-Type A_Male: Supplier Part: C112454; Supplier: LCSC; Manufacturer: SOFNG; Manufacturer Part: USB-05; Contributor: LCEDA_Lib
SW1-SW8 = Rotary_Encoder: Contributor: KiCAD; license: https://www.gnu.org/licenses/lgpl-2.1.html
U22 = GD32E230C8T6: Supplier: LCSC; Supplier Part: C380535; Manufacturer: GigaDevice Semicon Beijing; Contributor: LCSC; JLCPCB Part Class: Extended Part

## Nets
1V2: C4.1 C8.1 C9.1 C11.1 C33.1 C34.1 C35.1 C48.1 C49.1 C50.1 C53.1 C74.1 C75.1 C77.1 C138.1 C139.1 C140.1 L1.1 L4.1 U1.22(VDD-CORE) U1.35(VDD-CORE) U1.71(VDD-CORE) U3.5(VCCINT) U3.29(VCCINT) U3.45(VCCINT) U3.61(VCCINT) U3.78(VCCINT) U3.102(VCCINT) U3.116(VCCINT) U3.134(VCCINT) U10.2(VOUT) U10.4(VOUT)
2V5: C1.1 C5.1 C6.2 C42.1 C43.1 C44.1 C71.1 C72.1 C73.2 C137.1 J5.4 R9.1 R10.1 R28.2 R81.1 U1.30(VCC-DRAM) U1.31(VCC-DRAM) U1.32(VCC-DRAM) U1.34(VCC-DRAM) U1.36(VCC-DRAM) U3.35(VCCA1) U3.96(MSEL1) U3.107(VCCA2) U6.2(VOUT) U6.4(VOUT)
3V: C47.1 C54.1 U1.80(AVCC) U12.2(Vout)
3V3: C36.1 C37.1 C38.1 C39.1 C40.1 C58.1 C62.1 C63.1 C64.1 C76.1 D3.2 D12.1 D14.1 D16.2 P2.4(VDD) P3.7 P3.39 P3.44 Q1.2(E) Q2.2(E) Q3.2(E) Q4.2(E) Q5.2(E) Q6.2(E) R30.2 R36.2 R37.2 R38.2 R39.2 R40.2 R41.2 R42.2 R43.2 R51.1 U1.5(VCC-IO) U1.20(VCC-IO) U1.50(VCC-IO) U1.67(UVCC) U9.3(VOUT) U12.3(Vin)
3V3_A: C7.1 C10.1 C12.1 C14.1 C15.1 C16.1 C17.1 C18.1 C19.1 C20.1 C21.1 C22.1 C78.1 C79.1 C80.1 C113.2 C119.2 C144.1 C145.1 C146.1 D1.2 D2.2 R5.2 R8.1 R11.1 R12.1 R49.2 R50.2 U3.17(VCCIO1) U3.26(VCCIO2) U3.40(VCCIO3) U3.47(VCCIO3) U3.56(VCCIO4) U3.62(VCCIO4) U3.81(VCCIO5) U3.93(VCCIO6) U3.117(VCCIO7) U3.122(VCCIO7) U3.130(VCCIO8) U3.139(VCCIO8) U7.8(S1) U7.9(S2) U7.13(VD) U7.15(VDD) U7.28(VDD) U7.30(VD) U7.31(VD) U7.33(VDD) U7.46(VDD) U7.48(VD) U8.8(S1) U8.9(S2) U8.13(VD) U8.15(VDD) U8.28(VDD) U8.30(VD) U8.31(VD) U8.33(VDD) U8.46(VDD) U8.48(VD) U11.5(OUT) U13.1(VDD) U17.5(+V) U20.5(+V)
3V3_CPU: C120.1 C131.1 C132.1 C151.1 D16.1 R101.2 R102.2 R105.2 R110.2 R113.2 R114.2 R117.2 R122.2 R125.2 R128.2 R131.2 R132.2 R135.2 R138.2 R141.2 R146.2 R149.2 R150.1 R151.1 R152.1 R153.1 R154.1 R155.1 R156.2 R157.2 R158.2 R159.2 R160.2 R161.2 U22.1(VDD) U22.9(VDDA) U22.24(VDD) U22.48(VDD)
5V: C60.1 C61.1 C65.1 C66.1 C67.1 C68.1 C69.1 C70.1 C82.1 C141.1 C142.1 C143.1 C147.1 C148.1 L5.1 Q8.2(S) U6.3(VIN) U9.2(VIN) U9.4(VIN) U10.3(VIN) U11.1(IN) U11.3(EN) U14.5(+V) U15.4(EN) U15.5(VIN)
5V_IN: C95.1 C96.1 CON1.1 L6.1 Q8.3(D) R53.2 U16.6(IN)
10V3: C90.1 C91.1 P3.43 R44.2 ZD1.2(A)
15V8: C87.1 C88.1 D6.2(K) P3.41 R56.2 ZD1.1(K)
-6V3: C93.1 C94.1 D9.1(K) P3.42 R58.2
GND: C1.2 C4.2 C7.2 C8.2 C9.2 C10.2 C11.2 C12.2 C13.2 C14.2 C15.2 C16.2 C17.2 C18.2 C19.2 C20.2 C21.2 C22.2 C23.2 C24.2 C25.2 C26.2 C27.2 C28.2 C29.2 C30.2 C31.2 C32.2 C33.2 C34.2 C35.2 C36.2 C37.2 C38.2 C39.2 C40.2 C41.2 C42.2 C43.2 C44.2 C45.2 C46.2 C47.2 C48.2 C49.2 C50.2 C51.2 C52.2 C53.2 C54.2 C55.2 C56.2 C57.2 C58.2 C59.2 C60.2 C61.2 C62.2 C63.2 C64.2 C65.2 C66.2 C67.2 C68.2 C69.2 C70.2 C71.2 C72.2 C73.1 C74.2 C75.2 C76.2 C77.2 C78.2 C79.2 C80.2 C81.2 C82.2 C83.2 C85.2 C86.2 C87.2 C88.2 C90.2 C91.2 C92.2 C93.2 C94.2 C95.2 C96.2 C97.2 C98.2 C100.1 C101.1 C106.1 C111.1 C112.1 C113.1 C115.1 C116.2 C117.1 C119.1 C120.2 C121.1 C126.1 C131.2 C132.2 C135.2 C136.2 C137.2 C138.2 C139.2 C140.2 C141.2 C142.2 C143.2 C144.2 C145.2 C146.2 C147.2 C148.2 C150.2 C151.2 C152.2 C153.2 C154.2 C155.2 C156.2 C157.2 C158.2 C159.2 C160.2 C161.2 C162.2 C163.2 C164.2 C165.2 C166.2 C167.2 CON1.2 D8.2(K) D11.2 D15.2 J1.2 J2.2 J3.1 J5.2 J5.10 J6.2 K1.8 K2.8 K3.8 K4.8 K5.8 K6.8 L2.1 L3.1 P2.6(GND) P2.9(CARD_DETECT) P2.10(BODY) P3.5 P3.8 P3.17 P3.18 P3.19 P3.26 P3.27 P3.33 P3.34 P3.35 P3.36 P3.38 P3.40 P3.47 P3.48 P3.49 P3.50 Q7.2(E) R6.2 R7.2 R29.1 R31.1 R32.1 R45.1 R48.1 R57.1 R58.1 R59.1 R60.1 R61.1 R93.2 R94.2 R104.1 R107.1 R108.1 R111.1 R116.1 R119.1 R120.1 R123.1 R126.1 R129.1 R134.1 R137.1 R140.1 R143.1 R144.1 R147.1 S1.1 SW1.2(C) SW2.2(C) SW3.2(C) SW4.2(C) SW5.2(C) SW6.2(C) SW7.2(C) SW8.2(C) U1.74(TVGND) U1.82(AGND) U1.89(GND) U2.4(GND) U3.4(GND) U3.19(GND) U3.22(GND) U3.27(GND) U3.41(GND) U3.48(GND) U3.57(GND) U3.63(GND) U3.79(GND) U3.82(GND) U3.94(MSEL0) U3.95(GND) U3.97(MSEL2) U3.118(GND) U3.123(GND) U3.131(GND) U3.140(GND) U3.145(GND (PAD)) U4.4(GND) U5.4(VSS) U6.1(ADJ/GND) U7.1(GND) U7.4(DFS) U7.12(GND) U7.16(GND) U7.27(GND) U7.29(GND) U7.32(GND) U7.34(GND) U7.45(GND) U8.1(GND) U8.4(DFS) U8.12(GND) U8.16(GND) U8.27(GND) U8.29(GND) U8.32(GND) U8.34(GND) U8.45(GND) U9.1(GND) U10.1(ADJ/GND) U11.2(GND) U12.1(GND) U13.8(GND) U14.2(V-) U15.2(GND) U16.2(GND) U17.2(V-) U18.2(K) U19.2(K) U20.2(V-) U21.3(ANODE) U22.8(VSSA) U22.23(VSS) U22.44(BOOT0) U22.47(VSS) USB1.4(GND)
ADC1_D0A: U3.103((CLKUSR),DIFFIO R3p,IO) U8.37(D0A)
ADC1_D0B: U3.110((DQS0T/CQ1T,DPCLK6),DIFFIO_T20p,IO) U8.24(D0B)
ADC1_D1A: U3.101((nCEO),DIFFIO_R3n,IO) U8.38(D1A)
ADC1_D1B: U3.111(DIFFIO_T19p,IO) U8.23(D1B)
ADC1_D2A: U3.100(IO) U8.39(D2A)
ADC1_D2B: U3.112(PLL2_CLKOUTn,IO) U8.22(D2B)
ADC1_D3A: U3.99((CRC ERROR),DIFFIO_R4P,IO) U8.40(D3A)
ADC1_D3B: U3.113(PLL2_CLKOUTp,IO) U8.21(D3B)
ADC1_D4A: U3.98((INT DONE),DIFFIO R4n,IO) U8.41(D4A)
ADC1_D4B: U3.114((DQ1T),RUP4,IO) U8.20(D4B)
ADC1_D5A: U3.91(CLK4,DIFFCLK_2p) U8.42(D5A)
ADC1_D5B: U3.115((DQ1T),RDN4,IO) U8.19(D5B)
ADC1_D6A: U3.90(CLK5,DIFFCLK_2n) U8.43(D6A)
ADC1_D6B: U3.119(VREFB7N0,IO) U8.18(D6B)
ADC1_D7A: U3.89(CLK6,DIFFCLK_3p) U8.44(D7A (MSB))
ADC1_D7B: U3.120((DQ1T),DIFFIO_T16n,IO) U8.17(D7B (MSB))
ADC1_ENCA: U3.88(CLK7,DIFFCLK_3n) U8.47(ENCA)
ADC1_ENCB: U3.121(DIFFIO_T16p,IO) U8.14(ENCB)
ADC1_OFFSET: R26.1 U3.87((DEV_CLRn),DIFFIO_R7p,IO)
ADC2_D0A: U3.72(DIFFIO_B22p,IO) U7.37(D0A)
ADC2_D0B: U3.73(IO) U7.24(D0B)
ADC2_D1A: U3.71(DIFFIO_B21n,IO) U7.38(D1A)
ADC2_D1B: U3.74(IO) U7.23(D1B)
ADC2_D2A: U3.70(DIFFIO_B21p,IO) U7.39(D2A)
ADC2_D2B: U3.75(IO) U7.22(D2B)
ADC2_D3A: U3.69(IO) U7.40(D3A)
ADC2_D3B: U3.76(RUP3,IO) U7.21(D3B)
ADC2_D4A: U3.68((DQS0B/CQ1B,DPCLK3),DIFFIO_B20n,IO) U7.41(D4A)
ADC2_D4B: U3.77(RDN3,IO) U7.20(D4B)
ADC2_D5A: U3.67((DQ1B),RDN2,IO) U7.42(D5A)
ADC2_D5B: U3.80(VREFB5N0,IO) U7.19(D5B)
ADC2_D6A: U3.66((DQ1B),RUP2,IO) U7.43(D6A)
ADC2_D6B: U3.83(IO) U7.18(D6B)
ADC2_D7A: U3.65(VREFB4N0,IO) U7.44(D7A (MSB))
ADC2_D7B: U3.84(DIFFIO_R8n,IO) U7.17(D7B (MSB))
ADC2_ENCA: U3.64(IO) U7.47(ENCA)
ADC2_ENCB: U3.85((DQS1R/CQ1R#,DPCLK4),DIFFIO_R8p,IO) U7.14(ENCB)
ADC2_OFFSET: R24.1 U3.86((DEV_OE),DIFFIO_R7n,IO)
ANALOG1_AC_DC: R19.1 U18.1(A)
ANALOG1_ADC_INPUT: C114.1 K1.4 K1.5 R23.1 R69.2 U17.1(OUT)
ANALOG1_RELAIS1: Q1.1(B) R18.1
ANALOG1_RELAIS2: Q2.1(B) R17.1
ANALOG1_RELAIS3: Q3.1(B) R16.1
ANALOG2_AC_DC: R20.1 U19.1(A)
ANALOG2_ADC_INPUT: C118.1 K6.4 K6.5 R22.1 R73.2 U20.1(OUT)
ANALOG2_RELAIS1: Q6.1(B) R13.1
ANALOG2_RELAIS2: Q5.1(B) R14.1
ANALOG2_RELAIS3: Q4.1(B) R15.1
Backlight V+: C97.1 C98.1 D10.2(K) P3.1 P3.2 U16.5(OV)
Backlight V-: P3.3 P3.4 R60.2 R61.2 U16.3(FB)
CH1_POS_A: C155.1 R111.2 R112.1 U22.14(PA4)
CH1_POS_B: C154.1 R108.2 R109.1 U22.15(PA5)
CH1_RNG_A: C167.1 R147.2 R148.1 U22.13(PA3)
CH1_RNG_B: C166.1 R144.2 R145.1 U22.16(PA6)
CH2_POS_A: C156.1 R115.1 R116.2 U22.11(PA1)
CH2_POS_B: C157.1 R118.1 R119.2 U22.10(PA0)
CH2_RNG_A: C164.1 R139.1 R140.2 U22.6(PF1-OSCOUT)
CH2_RNG_B: C165.1 R142.1 R143.2 U22.12(PA2)
CLOCK_SCL: R50.1 U1.65(PA1/TPX2/DA_LRCK/UART1_CTS/SPI1_MOSI) U13.4(SCL)
CLOCK_SDA: R49.1 U1.66(PA0/TPX1/DA_BCLK/UART1_RTS/SPI1_CS) U13.5(SDA)
CONTROL_RX: U1.64(PA2/TPY1/PWM0/DA_IN/UART1_RX/SPI1_CLK) U22.30(PA9)
CONTROL_TX: U1.63(PA3/TPY2/IR_RX/DA_OUT/UART1_TX/SPI1_MISO) U22.31(PA10)
DAC_D0: R34.2 U3.38(DIFFIO_B1p,IO)
DAC_D1: R52.2 U3.39(DIFFIO_B1n,IO)
DAC_D2: R55.2 U3.42((DQS1B/CQ1B#,DPCLK2),IO)
DAC_D3: R84.2 U3.43(PLL1_CLKOUTp,IO)
DAC_D4: R86.2 U3.44(PLL1_CLKOUTn,IO)
DAC_D5: R88.2 U3.46(VREFB3N0,IO)
DAC_D6: R90.2 U3.49((DQ1B),DIFFIO_B9p,IO)
DAC_D7: R92.2 U3.50((DQ1B),DIFFIO_B9n,IO)
F1C100S_FPGA_CLK: U1.41(PE8/CSI_D5/UART2_RX/SPI1_MOSI) U3.1(IO)
F1C100S_FPGA_DB0: U1.49(PE0/CSI_HSYNC/LCD_D0/TWI2_SCK/UART0_RX) U3.135((DQ1T),DIFFIO_T8n,IO)
F1C100S_FPGA_DB1: U1.48(PE1/CSI_VSYNC/LCD_D1/TWI2_SDA/UART0_TX) U3.136(VREFB8N0,IO)
F1C100S_FPGA_DB2: U1.47(PE2/CSI_PCLK/LCD_D8/CLK_OUT) U3.137((DQ1T),(DATA5),IO)
F1C100S_FPGA_DB3: U1.46(PE3/CSI_D0/LCD_D9/DA_BCLK) U3.138((DATA6),IO)
F1C100S_FPGA_DB4: U1.45(PE4/CSI_D1/LCD_D16/DA_LRCK) U3.141(DIFFIO_T5p,IO)
F1C100S_FPGA_DB5: U1.44(PE5/CSI_D2/LCD_D17/DA_IN) U3.142((DQS1T/CQ1T#,DPCLK7),DIFFIO_T2p,IO)
F1C100S_FPGA_DB6: U1.43(PE6/CSI_D3/PWM1/DA_OUT/OWA_OUT) U3.143((DQ1T),DIFFIO_T1n,IO)
F1C100S_FPGA_DB7: U1.42(PE7/CSI_D4/UART2_TX/SPI1_CS) U3.144((DM1T),DIFFIO_T1p,IO)
F1C100S_FPGA_DCS: U1.39(PE10/CSI_D7/UART2_CTS/SPI1_MISO) U3.3(IO)
F1C100S_FPGA_RWS: U1.40(PE9/CSI_D6/UART2_RTS/SPI1_CLK) U3.2(IO)
FPGA_BACKLIGHT_PWM: R59.2 U3.7(VREFB1N0,IO) U16.4(EN)
FPGA_Conf_ASDO: J2.6 U3.6((DATA1,ASDO),DIFFIO_L1n,IO) U4.5(DI)
FPGA_Conf_CLK: J2.5 U3.12(DCLK) U4.6(CLK)
FPGA_Conf_Data: J2.3 R1.1 U3.13((DATA0),IO)
FPGA_Conf_nCE: J2.1 U3.8((FLASH_nCE,nCSO),DIFFIO_L2p,IO) U4.1(/CS)
FPGA_SPECIAL_IC_SCL: J3.3 R3.1 U3.34(IO) U5.6(SCL)
FPGA_SPECIAL_IC_SDA: J3.4 R2.1 U3.33(RDN1,IO) U5.5(SDA)
JTAG-TCK: J5.1
JTAG-TDI: J5.9
JTAG-TDO: J5.3
JTAG-TMS: J5.5
LCD_CLK: P3.37 U1.26(PD18/LCD_CLK/SPI0_CS)
LCD_D3: P3.16 U1.7(PD1/LCD_D3/UART1_RTS)
LCD_D4: P3.15 U1.8(PD2/LCD_D4/UART1_CTS)
LCD_D5: P3.14 U1.9(PD3/LCD_D5/UART1_RX)
LCD_D6: P3.13 U1.10(PD4/LCD_D6/UART1_TX)
LCD_D7: P3.12 U1.11(PD5/LCD_D7/TWI1_SCK)
LCD_D10: P3.25 U1.12(PD6/LCD_D10/TWI1_SDA)
LCD_D11: P3.24 U1.13(PD7/LCD_D11/DA_MCLK)
LCD_D12: P3.23 U1.14(PD8/LCD_D12/DA_BCLK)
LCD_D13: P3.22 U1.15(PD9/LCD_D13/DA_LRCK)
LCD_D14: P3.21 U1.16(PD10/LCD_D14/DA_IN)
LCD_D15: P3.20 U1.17(PD11/LCD_D15/DA_OUT)
LCD_D19: P3.32 U1.19(PD13/LCD_D19/UART2_TX)
LCD_D20: P3.31 U1.21(PD14/LCD_D20/UART2_RX)
LCD_D21: P3.30 U1.23(PD15/LCD_D21/UART2_RST/TWI2_SCK)
LCD_D22: P3.29 U1.24(PD16/LCD_D22/UART2_CTS/TWI2_SDA)
LCD_D23: P3.28 U1.25(PD17/LCD_D23/OWA_OUT)
LCD_DE: P3.9 U1.27(PD19/LCD_DE/SPI0_MOSI)
LCD_HSYNC: P3.11 R43.1 U1.28(PD20/LCD_HSYNC/SPI0_CLK)
LCD_VSYNC: P3.10 R42.1 U1.29(PD21/LCD_VSYNC/SPI0_MISO)
MATRIX_1A: R150.2 S2.1 S3.1 S4.1 S5.1 S6.1 S7.1 U22.43(PB7)
MATRIX_1B: R156.1 S2.2 S13.2 S19.2 S25.2 S31.2 U22.17(PA7)
MATRIX_2A: R151.2 S8.1 S9.1 S10.1 S11.1 S12.1 S13.1 U22.42(PB6)
MATRIX_2B: R157.1 S3.2 S12.2 S18.2 S24.2 S30.2 U22.18(PB0)
MATRIX_3A: R152.2 S14.1 S15.1 S16.1 S17.1 S18.1 S19.1 U22.41(PB5)
MATRIX_3B: R158.1 S4.2 S11.2 S17.2 S23.2 S29.2 S35.2 U22.19(PB1)
MATRIX_4A: R153.2 S20.1 S21.1 S22.1 S23.1 S24.1 S25.1 U22.40(PB4)
MATRIX_4B: R159.1 S5.2 S10.2 S16.2 S22.2 S28.2 S34.2 U22.20(PB2)
MATRIX_5A: R154.2 S26.1 S27.1 S28.1 S29.1 S30.1 S31.1 U22.39(PB3)
MATRIX_5B: R160.1 S6.2 S9.2 S15.2 S21.2 S27.2 S33.2 U22.21(PB10)
MATRIX_6A: R155.2 S32.1 S33.1 S34.1 S35.1 U22.38(PA15)
MATRIX_6B: R161.1 S7.2 S8.2 S14.2 S20.2 S26.2 S32.2 U22.22(PB11)
MCU_FLASH_CE: J1.1 R33.1 U1.60(PC1/SPI0_CS/SDC1_CMD) U2.1(/CS)
MCU_FLASH_CLK: J1.5 U1.59(PC0/SPI0_CLK/SDC1_CLK) U2.6(CLK)
MCU_FLASH_MISO: J1.3 U1.61(PC2/SPI0_MISO/SDC1_D0) U2.2(DO)
MCU_FLASH_MOSI: J1.6 U1.62(PC3/SPI0_MOSI/UART0_TX) U2.5(DI)
POWER_HOLD: R47.2 R48.2 U22.33(PA12)
POWER_ON/OFF: D5.2 R51.2 U22.32(PA11)
SELECT_A: C152.1 R103.1 R104.2 U22.26(PB13)
SELECT_B: C153.1 R106.1 R107.2 U22.25(PB12)
SWCLK: J6.4 U22.37(PA14)
SWDIO: J6.3 U22.34(PA13)
TRG_LVL_A: C161.1 R129.2 R130.1 U22.3(PC14-OSC32IN)
TRG_LVL_B: C160.1 R126.2 R127.1 U22.2(PC13)
TRG_POS_A: C159.1 R123.2 R124.1 U22.46(PB9)
TRG_POS_B: C158.1 R120.2 R121.1 U22.45(PB8)
TRG_RNG\_A: C162.1 R133.1 R134.2 U22.4(PC15-OSC32OUT)
TRG_RNG_B: C163.1 R136.1 R137.2 U22.5(PF0-OSCIN)
USB-DM: U1.68(USB-DM) USB1.2(D-)
USB-DP: U1.69(USB-DP) USB1.3(D+)
VRF1: C83.1 C84.2 C100.2 C101.2 C106.2 C107.1 C108.1 C109.1 C110.1 C111.2 C112.2 C115.2 C117.2 C121.2 C122.1 C123.1 C124.1 C125.1 C126.2 C134.2 C135.1 C149.2 C150.1 D11.1 D12.2 R66.2 R67.2 R68.1 R70.1 R71.2 R72.1 R74.1 R75.2 R76.2 R81.2 R97.2 R98.2 U21.1(CATHODE) U21.2(REF)
Net-(C2-1): C2.1 L1.2 U3.37(VCCD_PLL1)
Net-(C2-2): C2.2 C5.2 L2.2 U3.36(GNDA1)
Net-(C3-1): C3.1 L4.2 U3.109(VCCD_PLL2)
Net-(C3-2): C3.2 C6.1 L3.2 U3.108(GNDA2)
Net-(C13-1): C13.1 R5.1 U3.25(CLK3,DIFFCLK_1n)
Net-(C23-1): C23.1 U7.5(REFINA) U7.6(REFOUT) U7.7(REFINB)
Net-(C24-1): C24.1 U8.5(REFINA) U8.6(REFOUT) U8.7(REFINB)
Net-(C25-1): C25.1 R24.2 R25.1
Net-(C26-1): C26.1 C27.1 R25.2 U7.3(AINA) U7.10(AINB)
Net-(C28-1): C28.1 C29.1 R27.2 U8.3(AINA) U8.10(AINB)
Net-(C30-1): C30.1 R26.2 R27.1
Net-(C31-1): C31.1 U1.52(HOSCO) X1.1(OSC1)
Net-(C32-1): C32.1 U1.51(HOSCI) X1.2(OSC2)
Net-(C41-1): C41.1 C45.1 D2.1 J3.2 R2.2 R3.2 U5.8(VCC)
Net-(C46-1): C46.1 R28.1 R29.2 U1.33(SVREF)
Net-(C51-1): C51.1 C52.1 D1.1 J2.4 U4.3(/WP) U4.7(/HOLD) U4.8(VCC)
Net-(C55-1): C55.1 R31.2 U1.81(VRA1)
Net-(C56-1): C56.1 R32.2 U1.83(VRA2)
Net-(C57-1): C57.1 C136.1 D3.1 J1.4 R33.2 U2.3(/WP) U2.7(/HOLD) U2.8(VCC)
Net-(C59-1): C59.1 P3.6 P3.46 R44.1 R45.2
Net-(C81-1): C81.1 R34.1 R35.1 R94.1 U14.3(+IN)
Net-(C84-1): C84.1 C85.1 R82.2 R97.1
Net-(C86-1): C86.1 C149.1 R98.1 R99.2
Net-(C89-1): C89.1 D7.2(K) D8.1(A)
Net-(C89-2): C89.2 D6.1(A) L5.2 U15.1(SW)
Net-(C92-1): C92.1 D7.1(A) D9.2(A)
Net-(C99-1): C99.1 RF1.5 U18.3(S1)
Net-(C99-2): C99.2 R62.2 U18.4(S)
Net-(C102-1): C102.1 C103.1 C104.1 C105.1 R62.1 R63.2 R64.2 R65.2
Net-(C102-2): C102.2 C107.2 C108.2 K2.2 K2.7 R63.1 R66.1
Net-(C103-2): C103.2 C109.2 C110.2 K2.4 K2.5 R64.1 R67.1
Net-(C104-2): C104.2 C105.2 K3.4 K3.5 R65.1 R68.2
Net-(C114-2): C114.2 K1.3 K1.6 R69.1 U17.4(-IN)
Net-(C116-1): C116.1 C134.1 R71.1 R100.2
Net-(C118-2): C118.2 K6.3 K6.6 R73.1 U20.4(-IN)
Net-(C122-2): C122.2 C123.2 C129.2 K5.4 K5.5 R75.1 R78.1
Net-(C124-2): C124.2 C125.2 C130.2 K5.2 K5.7 R76.1 R79.1
Net-(C127-1): C127.1 C128.1 C129.1 C130.1 R77.2 R78.2 R79.2 R80.1
Net-(C127-2): C127.2 C128.2 K4.4 K4.5 R74.2 R77.1
Net-(C133-1): C133.1 RF2.5 U19.3(S1)
Net-(C133-2): C133.2 R80.2 U19.4(S)
Net-(D4-1): D4.1 D5.1 S1.2
Net-(D4-2): D4.2 D13.2 R46.2
Net-(D10-1): D10.1(A) L6.2 U16.1(SW)
Net-(D13-1): D13.1 Q7.3(C)
Net-(D14-2): D14.2 D15.1 R95.2 R96.2 U14.4(-IN)
Net-(J4-1): J4.1 R30.1 U1.70(RESET)
Net-(K1-1): K1.1 Q1.3(C)
Net-(K1-2): K1.2 K1.7 R70.2
Net-(K2-1): K2.1 Q2.3(C)
Net-(K2-3): K2.3 K2.6 K3.2 K3.7
Net-(K3-1): K3.1 Q3.3(C)
Net-(K3-3): K3.3 K3.6 U17.3(+IN)
Net-(K4-1): K4.1 Q4.3(C)
Net-(K4-2): K4.2 K4.7 K5.3 K5.6
Net-(K4-3): K4.3 K4.6 U20.3(+IN)
Net-(K5-1): K5.1 Q5.3(C)
Net-(K6-1): K6.1 Q6.3(C)
Net-(K6-2): K6.2 K6.7 R72.2
Net-(P2-1): P2.1(DAT2) R36.1 U1.53(PF5/SDC0_D2/DBG_CK/PWM1)
Net-(P2-2): P2.2(CD/DAT3) R37.1 U1.54(PF4/SDC0_D3/UART0_TX)
Net-(P2-3): P2.3(CMD) R38.1 U1.55(PF3/SDC0_CMD/DBG_DO)
Net-(P2-5): P2.5(CLK) R39.1 U1.56(PF2/SDC0_CLK/UART0_RX)
Net-(P2-7): P2.7(DAT0) R40.1 U1.57(PF1/SDC0_D0/DBG_DI)
Net-(P2-8): P2.8(DAT1) R41.1 U1.58(PF0/SDC0_D1/DBG_MS/IR_RX)
Net-(Q7-1): Q7.1(B) R47.1
Net-(Q8-1): Q8.1(G) R46.1 R53.1
Net-(R1-2): R1.2 U4.2(DO)
Net-(R4-1): R4.1 U3.23(CLK1,DIFFCLK_0n)
Net-(R4-2): R4.2 U13.10(CLK0)
Net-(R6-1): R6.1 U3.21(nCE)
Net-(R7-1): R7.1 U3.16(TCK)
Net-(R8-2): R8.2 U3.9(nSTATUS)
Net-(R9-2): R9.2 U3.15(TDI)
Net-(R10-2): R10.2 U3.18(TMS)
Net-(R11-2): R11.2 U3.14(nCONFIG)
Net-(R12-2): R12.2 U3.92(CONF_DONE)
Net-(R13-2): R13.2 U3.124(DIFFIO_T13p,IO)
Net-(R14-2): R14.2 U3.125(IO)
Net-(R15-2): R15.2 U3.126(DIFFIO_T12n,IO)
Net-(R16-2): R16.2 U3.127(DIFFIO_T12p,IO)
Net-(R17-2): R17.2 U3.128(DIFFIO_T11n,IO)
Net-(R18-2): R18.2 U3.129(DIFFIO_T11p,IO)
Net-(R19-2): R19.2 U3.132((DQ1T),(DATA2),DIFFIO_T10n,IO)
Net-(R20-2): R20.2 U3.133((DQ1T),(DATA3),DIFFIO_T10p,IO)
Net-(R21-1): R21.1 U3.24(CLK2,DIFFCLK_1p)
Net-(R21-2): R21.2 U13.9(CLK1)
Net-(R22-2): R22.2 U7.2(AINA) U7.11(AINB)
Net-(R23-2): R23.2 U8.2(AINA) U8.11(AINB)
Net-(R35-2): R35.2 R52.1 R54.1
Net-(R54-2): R54.2 R55.1 R83.1
Net-(R56-1): R56.1 R57.2 U15.3(FB)
Net-(R82-1): R82.1 RF3.1 RF3.2 RF3.3 RF3.4
Net-(R83-2): R83.2 R84.1 R85.1
Net-(R85-2): R85.2 R86.1 R87.1
Net-(R87-2): R87.2 R88.1 R89.1
Net-(R89-2): R89.2 R90.1 R91.1
Net-(R91-2): R91.2 R92.1 R93.1
Net-(R95-1): R95.1 U14.1(OUT)
Net-(R96-1): R96.1 RF3.5
Net-(R99-1): R99.1 RF2.1 RF2.2 RF2.3 RF2.4
Net-(R100-1): R100.1 RF1.1 RF1.2 RF1.3 RF1.4
Net-(R101-1): R101.1 U22.7(NRST)
Net-(R102-1): R102.1 R103.2 SW1.1(A)
Net-(R105-1): R105.1 R106.2 SW1.3(B)
Net-(R109-2): R109.2 R110.1 SW2.3(B)
Net-(R112-2): R112.2 R113.1 SW2.1(A)
Net-(R114-1): R114.1 R115.2 SW3.1(A)
Net-(R117-1): R117.1 R118.2 SW3.3(B)
Net-(R121-2): R121.2 R122.1 SW4.3(B)
Net-(R124-2): R124.2 R125.1 SW4.1(A)
Net-(R127-2): R127.2 R128.1 SW5.3(B)
Net-(R130-2): R130.2 R131.1 SW5.1(A)
Net-(R132-1): R132.1 R133.2 SW6.1(A)
Net-(R135-1): R135.1 R136.2 SW6.3(B)
Net-(R138-1): R138.1 R139.2 SW7.1(A)
Net-(R141-1): R141.1 R142.2 SW7.3(B)
Net-(R145-2): R145.2 R146.1 SW8.3(B)
Net-(R148-2): R148.2 R149.1 SW8.1(A)
Net-(U13-2): U13.2(XA) X2.2(OSC2)
Net-(U13-3): U13.3(XB) X2.1(OSC1)

Not connected (* = marked no-connect by the designer): J5 6 7 8; J6 1; P3 45; U1 1(HPL) 2(HPCOMFB) 3(HPCOM) 4(HPVCC) 6(PD0/LCD_D2/TWI0_SDA) 18(PD12/LCD_D18/TWI0_SCK) 37(PE12/DA_MCLK/TWI0_SDA/PWM0) 38(PE11/CLK_OUT/TWI0_SCK/IR_RX) 72(TVOUT) 73(TV_VCC) 75(TV_VRN) 76(TV_VRP) 77(TVIN1) 78(TVIN0) 79(LRADC0) 84(FMINL) 85(FMINR) 86(LINEIN) 87(MICIN) 88(HPR); U3 10((DQS0L/CQ1L,DPCLK0),DIFFIO_L4p,IO) 11(DIFFIO_L4n,IO) 20(TDO) 28(DIFFIO_L6n,IO) 30((DQS1L/CQ1L#,DPCLK1),DIFFIO_L8p,IO) 31(VREFB2N0,IO) 32(RUP1,IO) 51((DQ1B),DIFFIO_B10p,IO) 52(DIFFIO_B11p,IO) 53(DIFFIO_B11n,IO) 54(DIFFIO_B12p,IO) 55(DIFFIO_B12n,IO) 58((DQ1B),DIFFIO_B15p,IO) 59((DQ1B),DIFFIO_B16p,IO) 60((DQ1B),DIFFIO_B16n,IO) 104((DQS0R/CQ1R,DPCLK5),IO) 105(VERFB6N0,IO) 106(DIFFIO_R1n,IO); U5 1(A0) 2(A1) 3(A2) 7(WP); U7 25(NC) 26(NC) 35(NC) 36(NC); U8 25(NC) 26(NC) 35(NC) 36(NC); U11 4(N/C); U13 6(CLK2) 7(VDDO); U22 27(PB14) 28(PB15) 29(PA8) 35(PF6) 36(PF7); USB1 1(VCC) 5 6

## Notes on the sheets
sheet 1
- Capacitors are undeterminded.
- (0 = read, 1 = write)
- (rising edge active)
- (0 = data, 1 = command)
- FLASH CONNECTOR PINOUT
- PIN
- FUNCTION
- 1
- SPI-CE
- 2
- GND
- 3
- SPI-MISO
- 4
- 3V3
- 5
- SPI-CLK
- 6
- SPI-MOSI
sheet 2
- Capacitors are undeterminded.
- FPGA Configuration scheme is Active Serial 3V3 (MSEL inputs)
sheet 3
- Capacitors are undeterminded.
sheet 4
- Capacitors are undeterminded.
- The TL432 is a 1.25V version
sheet 5
- Capacitors are undeterminded.
- For the ADC's offset binary output is selected (DFS input low)
- The data align mode is enabled (S1, S2 inputs high)
- (rising edge active)
- (0 = read, 1 = write)
- (0 = data, 1 = command)
sheet 6
- Capacitors are undeterminded.
- (USART0_RX)
- (USART0_TX)
